# EAGLE schematic main (EAGLE 8.3.2)
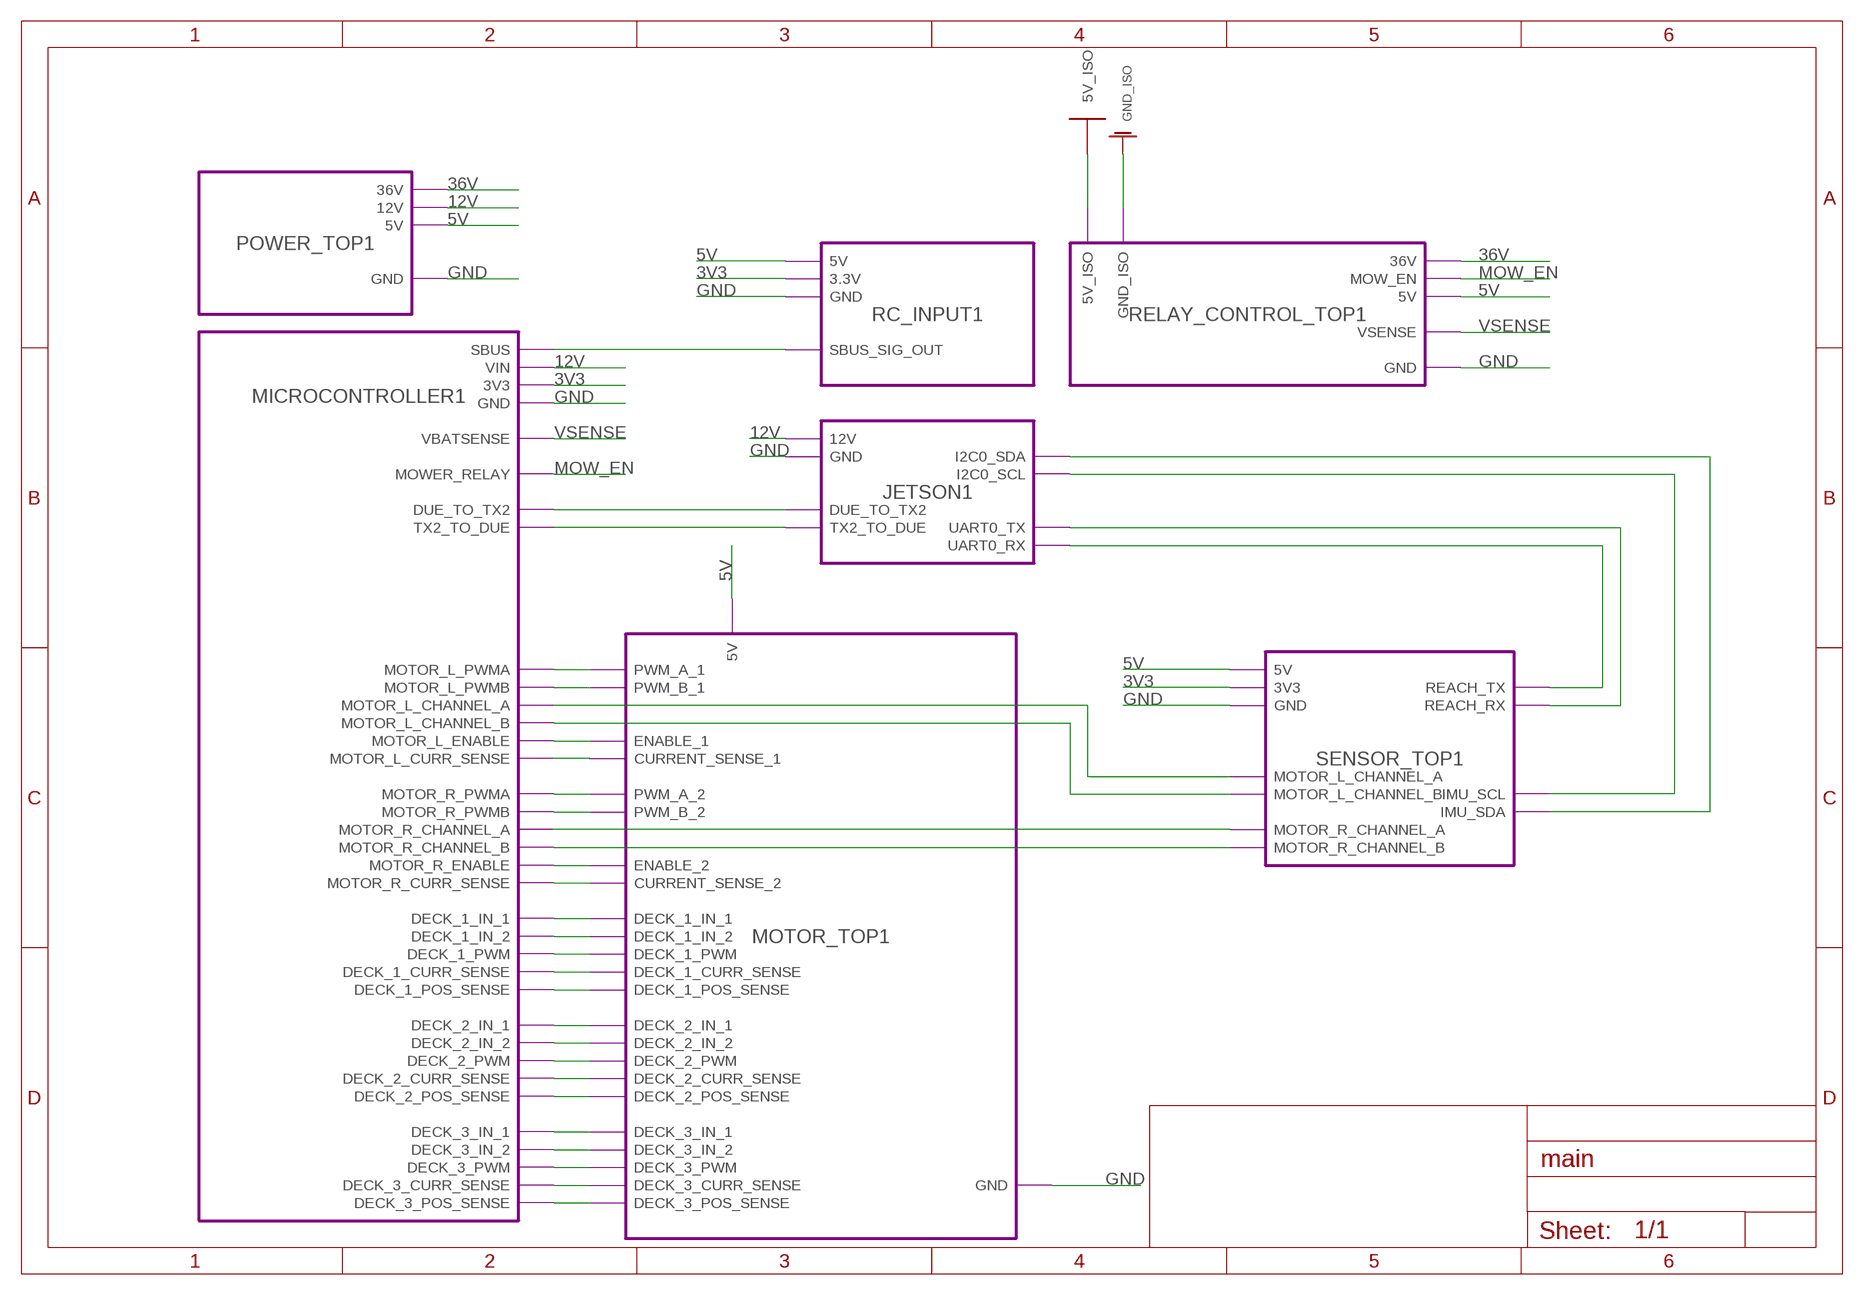
[diagram p0: schematic, sheet 1]

## Module instances
MICROCONTROLLER1 = UC
POWER_TOP1 = PWR
JETSON1 = JETSON
SENSOR_TOP1 = SNS
MOTOR_TOP1 = MTR
RC_INPUT1 = RC
RELAY_CONTROL_TOP1 = RL

## Nets
3V3: port MICROCONTROLLER1.3V3 RC_INPUT1.3.3V SENSOR_TOP1.3V3
5V: port POWER_TOP1.5V RC_INPUT1.5V SENSOR_TOP1.5V RELAY_CONTROL_TOP1.5V MOTOR_TOP1.5V
5V_ISO: port RELAY_CONTROL_TOP1.5V_ISO
12V: port POWER_TOP1.12V JETSON1.12V MICROCONTROLLER1.VIN
36V: port RELAY_CONTROL_TOP1.36V POWER_TOP1.36V
GND: port MICROCONTROLLER1.GND RC_INPUT1.GND POWER_TOP1.GND JETSON1.GND MOTOR_TOP1.GND SENSOR_TOP1.GND RELAY_CONTROL_TOP1.GND
GND_ISO: port RELAY_CONTROL_TOP1.GND_ISO
MOW_EN: port RELAY_CONTROL_TOP1.MOW_EN MICROCONTROLLER1.MOWER_RELAY
N$1: port MOTOR_TOP1.PWM_B_2 MICROCONTROLLER1.MOTOR_R_PWMB
N$2: port JETSON1.UART0_RX SENSOR_TOP1.REACH_TX
N$3: port MICROCONTROLLER1.MOTOR_L_ENABLE MOTOR_TOP1.ENABLE_1
N$4: port MICROCONTROLLER1.MOTOR_L_CURR_SENSE MOTOR_TOP1.CURRENT_SENSE_1
N$5: port MICROCONTROLLER1.MOTOR_R_PWMA MOTOR_TOP1.PWM_A_2
N$6: port JETSON1.UART0_TX SENSOR_TOP1.REACH_RX
N$7: port MICROCONTROLLER1.MOTOR_R_ENABLE MOTOR_TOP1.ENABLE_2
N$8: port MICROCONTROLLER1.MOTOR_R_CURR_SENSE MOTOR_TOP1.CURRENT_SENSE_2
N$9: port MICROCONTROLLER1.DECK_3_IN_1 MOTOR_TOP1.DECK_3_IN_1
N$10: port MICROCONTROLLER1.DECK_3_IN_2 MOTOR_TOP1.DECK_3_IN_2
N$11: port MICROCONTROLLER1.DECK_3_PWM MOTOR_TOP1.DECK_3_PWM
N$12: port MICROCONTROLLER1.DECK_3_POS_SENSE MOTOR_TOP1.DECK_3_POS_SENSE
N$13: port MICROCONTROLLER1.DECK_3_CURR_SENSE MOTOR_TOP1.DECK_3_CURR_SENSE
N$14: port MICROCONTROLLER1.DECK_2_POS_SENSE MOTOR_TOP1.DECK_2_POS_SENSE
N$15: port MICROCONTROLLER1.DECK_2_CURR_SENSE MOTOR_TOP1.DECK_2_CURR_SENSE
N$16: port MICROCONTROLLER1.DECK_2_PWM MOTOR_TOP1.DECK_2_PWM
N$17: port MICROCONTROLLER1.DECK_2_IN_2 MOTOR_TOP1.DECK_2_IN_2
N$18: port MICROCONTROLLER1.DECK_2_IN_1 MOTOR_TOP1.DECK_2_IN_1
N$19: port JETSON1.I2C0_SCL SENSOR_TOP1.IMU_SCL
N$20: port JETSON1.I2C0_SDA SENSOR_TOP1.IMU_SDA
N$21: port MICROCONTROLLER1.DECK_1_POS_SENSE MOTOR_TOP1.DECK_1_POS_SENSE
N$22: port MICROCONTROLLER1.DECK_1_CURR_SENSE MOTOR_TOP1.DECK_1_CURR_SENSE
N$23: port MICROCONTROLLER1.DECK_1_PWM MOTOR_TOP1.DECK_1_PWM
N$24: port MICROCONTROLLER1.DECK_1_IN_2 MOTOR_TOP1.DECK_1_IN_2
N$25: port MICROCONTROLLER1.DECK_1_IN_1 MOTOR_TOP1.DECK_1_IN_1
N$26: port MICROCONTROLLER1.MOTOR_L_PWMB MOTOR_TOP1.PWM_B_1
N$27: port MICROCONTROLLER1.MOTOR_L_PWMA MOTOR_TOP1.PWM_A_1
N$28: port JETSON1.TX2_TO_DUE MICROCONTROLLER1.TX2_TO_DUE
N$29: port MICROCONTROLLER1.DUE_TO_TX2 JETSON1.DUE_TO_TX2
N$30: port RC_INPUT1.SBUS_SIG_OUT MICROCONTROLLER1.SBUS
N$31: port MICROCONTROLLER1.MOTOR_L_CHANNEL_A SENSOR_TOP1.MOTOR_L_CHANNEL_A
N$32: port MICROCONTROLLER1.MOTOR_L_CHANNEL_B SENSOR_TOP1.MOTOR_L_CHANNEL_B
N$33: port SENSOR_TOP1.MOTOR_R_CHANNEL_A MICROCONTROLLER1.MOTOR_R_CHANNEL_A
N$34: port MICROCONTROLLER1.MOTOR_R_CHANNEL_B SENSOR_TOP1.MOTOR_R_CHANNEL_B
VSENSE: port MICROCONTROLLER1.VBATSENSE RELAY_CONTROL_TOP1.VSENSE

## Library data of the parts

## Module IMU
Ports: GND(pwr) IMU_SCL(io) IMU_SDA(io) IMU_VCC(pwr)
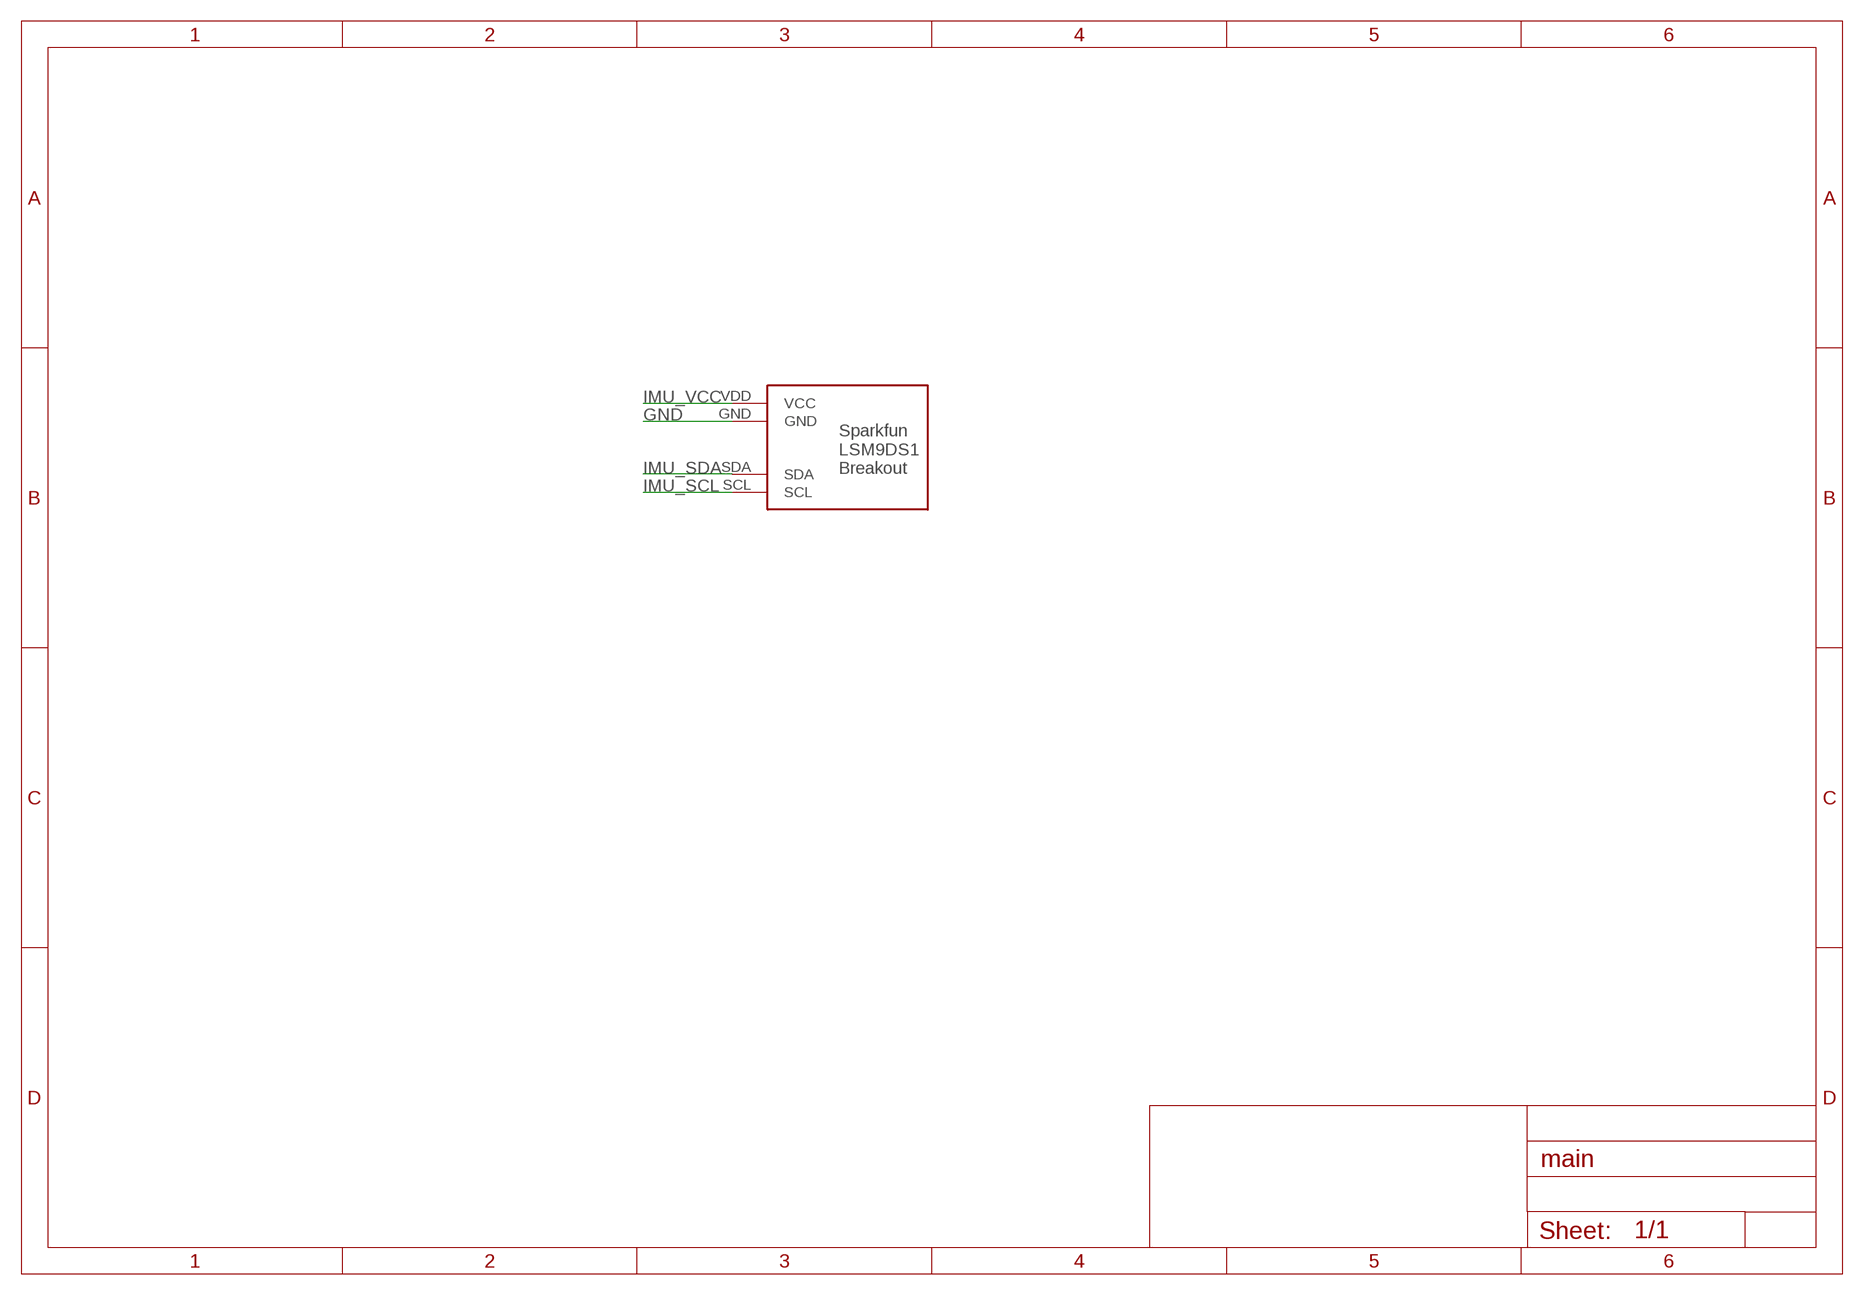
[diagram p1: schematic, module IMU, sheet 1]

### Parts
U$1  LSM9DS1  [SPARKFUN-9DOF-BREAKOUT]

### Nets
GND: U$1.GND
IMU_SCL: U$1.SCL
IMU_SDA: U$1.SDA
IMU_VCC: U$1.VDD(VCC)

### Library data of the parts
U$1 = sparkfun-IMU:LSM9DS1; DESCRIPTION: 9DoF IMU Breakout; MANUFACTURER: Sparkfun; MPN: LSM9DS1-Breakout

## Module UC
Ports: MOTOR_L_CURR_SENSE(io) MOTOR_L_ENABLE(io) MOTOR_L_CHANNEL_B(io) MOTOR_L_CHANNEL_A(io) MOTOR_L_PWMB(io) MOTOR_L_PWMA(io) MOTOR_R_PWMA(io) MOTOR_R_PWMB(io) MOTOR_R_CHANNEL_A(io) MOTOR_R_CHANNEL_B(io) MOTOR_R_ENABLE(io) MOTOR_R_CURR_SENSE(io) SBUS(io) MOWER_RELAY(io) VBATSENSE(io) GND(pwr) DECK_1_IN_1(io) DECK_1_IN_2(io) DECK_1_PWM(io) DECK_1_CURR_SENSE(io) DECK_1_POS_SENSE(io) DECK_2_IN_1(io) DECK_2_IN_2(io) DECK_2_PWM(io) DECK_2_CURR_SENSE(io) DECK_2_POS_SENSE(io) DECK_3_IN_1(io) DECK_3_IN_2(io) DECK_3_PWM(io) DECK_3_CURR_SENSE(io) DECK_3_POS_SENSE(io) DUE_TO_TX2(io) TX2_TO_DUE(io) 3V3(pwr) VIN(pwr)
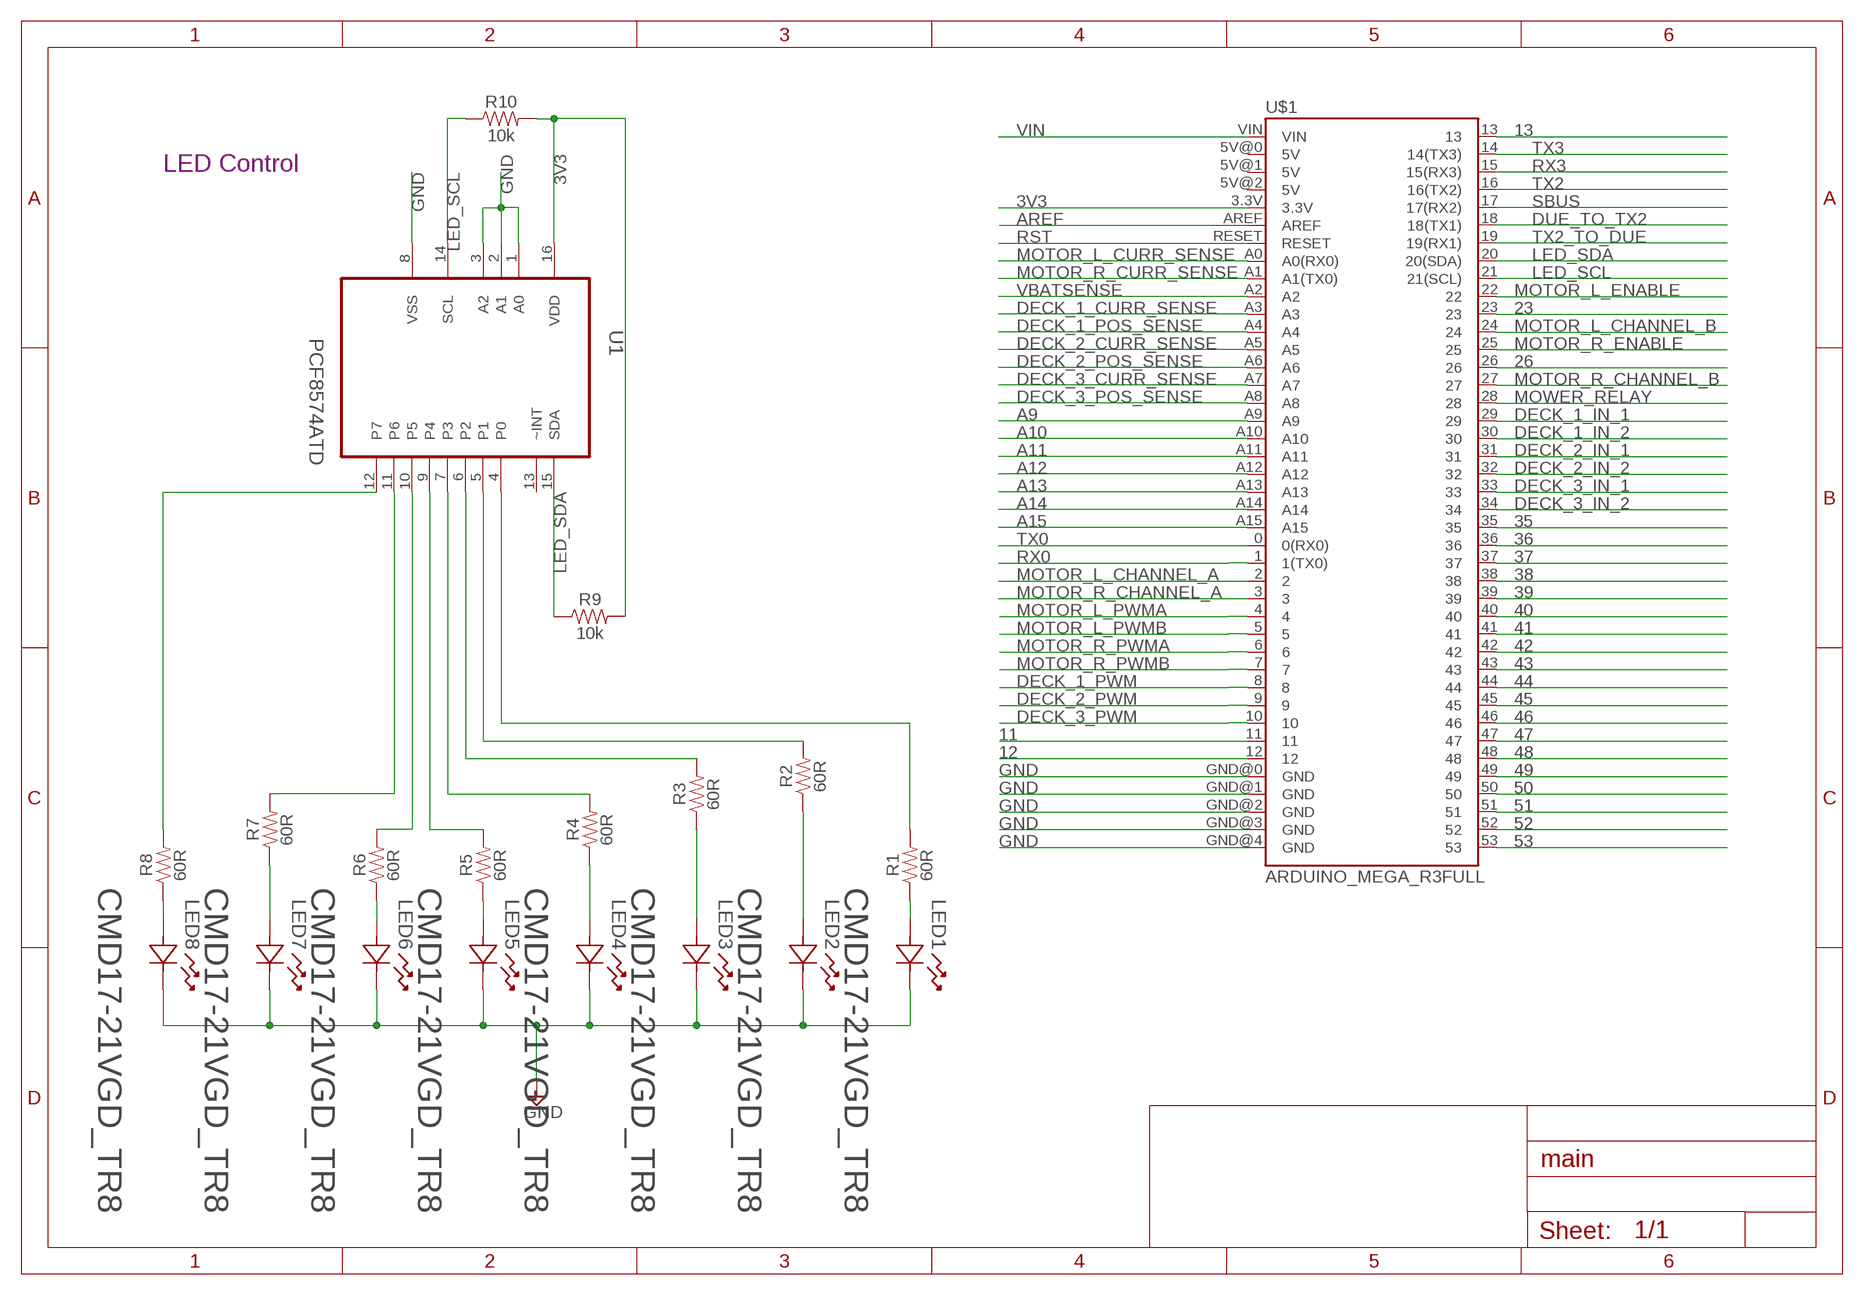
[diagram p2: schematic, module UC, sheet 1]

### Parts
LED1  CMD17-21VGD_TR8  [LED_CMD17-21VGD_TR8]
LED2  CMD17-21VGD_TR8  [LED_CMD17-21VGD_TR8]
LED3  CMD17-21VGD_TR8  [LED_CMD17-21VGD_TR8]
LED4  CMD17-21VGD_TR8  [LED_CMD17-21VGD_TR8]
LED5  CMD17-21VGD_TR8  [LED_CMD17-21VGD_TR8]
LED6  CMD17-21VGD_TR8  [LED_CMD17-21VGD_TR8]
LED7  CMD17-21VGD_TR8  [LED_CMD17-21VGD_TR8]
LED8  CMD17-21VGD_TR8  [LED_CMD17-21VGD_TR8]
R1  60R  60OHM-0603-1/10W-5%  [0603]
R2  60R  60OHM-0603-1/10W-5%  [0603]
R3  60R  60OHM-0603-1/10W-5%  [0603]
R4  60R  60OHM-0603-1/10W-5%  [0603]
R5  60R  60OHM-0603-1/10W-5%  [0603]
R6  60R  60OHM-0603-1/10W-5%  [0603]
R7  60R  60OHM-0603-1/10W-5%  [0603]
R8  60R  60OHM-0603-1/10W-5%  [0603]
R9  10k  10KOHM-0603-1/10W-5%  [0603]
R10  10k  10KOHM-0603-1/10W-5%  [0603]
U1  PCF8574ATD  [SOIC127P1032X265-16N]
U$1  ARDUINO_MEGA_R3FULL  [ARDUINO_MEGA]

### Nets
3V3: R9.2 R10.2 U1.16(VDD) U$1.3.3V
11: U$1.11
12: U$1.12
13: U$1.13
23: U$1.23
26: U$1.26
35: U$1.35
36: U$1.36
37: U$1.37
38: U$1.38
39: U$1.39
40: U$1.40
41: U$1.41
42: U$1.42
43: U$1.43
44: U$1.44
45: U$1.45
46: U$1.46
47: U$1.47
48: U$1.48
49: U$1.49
50: U$1.50
51: U$1.51
52: U$1.52
53: U$1.53
A9: U$1.A9
A10: U$1.A10
A11: U$1.A11
A12: U$1.A12
A13: U$1.A13
A14: U$1.A14
A15: U$1.A15
AREF: U$1.AREF
DECK_1_CURR_SENSE: U$1.A3
DECK_1_IN_1: U$1.29
DECK_1_IN_2: U$1.30
DECK_1_POS_SENSE: U$1.A4
DECK_1_PWM: U$1.8
DECK_2_CURR_SENSE: U$1.A5
DECK_2_IN_1: U$1.31
DECK_2_IN_2: U$1.32
DECK_2_POS_SENSE: U$1.A6
DECK_2_PWM: U$1.9
DECK_3_CURR_SENSE: U$1.A7
DECK_3_IN_1: U$1.33
DECK_3_IN_2: U$1.34
DECK_3_POS_SENSE: U$1.A8
DECK_3_PWM: U$1.10
DUE_TO_TX2: U$1.18(18(TX1))
GND: LED1.2 LED2.2 LED3.2 LED4.2 LED5.2 LED6.2 LED7.2 LED8.2 U1.1(A0) U1.2(A1) U1.3(A2) U1.8(VSS) U$1.GND@0(GND) U$1.GND@1(GND) U$1.GND@2(GND) U$1.GND@3(GND) U$1.GND@4(GND)
LED_SCL: R10.1 U1.14(SCL) U$1.21(21(SCL))
LED_SDA: R9.1 U1.15(SDA) U$1.20(20(SDA))
MOTOR_L_CHANNEL_A: U$1.2
MOTOR_L_CHANNEL_B: U$1.24
MOTOR_L_CURR_SENSE: U$1.A0(A0(RX0))
MOTOR_L_ENABLE: U$1.22
MOTOR_L_PWMA: U$1.4
MOTOR_L_PWMB: U$1.5
MOTOR_R_CHANNEL_A: U$1.3
MOTOR_R_CHANNEL_B: U$1.27
MOTOR_R_CURR_SENSE: U$1.A1(A1(TX0))
MOTOR_R_ENABLE: U$1.25
MOTOR_R_PWMA: U$1.6
MOTOR_R_PWMB: U$1.7
MOWER_RELAY: U$1.28
N$1: LED8.1 R8.1
N$2: R1.2 U1.4(P0)
N$3: LED7.1 R7.1
N$12: LED6.1 R6.1
N$13: LED5.1 R5.1
N$14: LED4.1 R4.1
N$15: LED3.1 R3.1
N$16: LED2.1 R2.1
N$17: LED1.1 R1.1
N$18: R8.2 U1.12(P7)
N$19: R7.2 U1.11(P6)
N$20: R6.2 U1.10(P5)
N$21: R5.2 U1.9(P4)
N$22: R4.2 U1.7(P3)
N$23: R3.2 U1.6(P2)
N$24: R2.2 U1.5(P1)
RST: U$1.RESET
RX0: U$1.1(1(TX0))
RX3: U$1.15(15(RX3))
SBUS: U$1.17(17(RX2))
TX0: U$1.0(0(RX0))
TX2: U$1.16(16(TX2))
TX2_TO_DUE: U$1.19(19(RX1))
TX3: U$1.14(14(TX3))
VBATSENSE: U$1.A2
VIN: U$1.VIN
Unconnected: U1.13(~INT) U$1.5V@0(5V) U$1.5V@1(5V) U$1.5V@2(5V)

### Notes on the sheet
- LED Control

### Library data of the parts
LED1-LED8 = CMD17-21VGD_TR8:CMD17-21VGD_TR8: LED, GREEN, 7MCD, 570NM; AVAILABILITY: Good; DESCRIPTION: Led, Green, 1.25mm x 1.4mm, 7mcd, 570nm, Full Reel; MANUFACTURER: Chicago Miniature Lighting; MPN: CMD17-21VGD/TR8; PACKAGE: 0805 Chicago Miniature Lighting; PRICE: 0.18 USD
R1-R8 = passive:60OHM: 2kΩ resistor A resistor is a passive two-terminal electrical component that implements electrical resistance as a circuit element. Resistors act to reduce current flow, and, at the same time, act to lower voltage levels within circuits. - Wikipedia; DESCRIPTION: RES SMD 60.4 OHM 1% 1/10W 0603; MANUFACTURER: Yageo; MPN: RC0603FR-0760R4L
R9 R10 = passive:10KOHM: 2kΩ resistor A resistor is a passive two-terminal electrical component that implements electrical resistance as a circuit element. Resistors act to reduce current flow, and, at the same time, act to lower voltage levels within circuits. - Wikipedia; DESCRIPTION: RES SMD 10K OHM 1% 1/10W 0603; MANUFACTURER: Yageo; MPN: RC0603FR-0710KL
U1 = PCF8574ATD:PCF8574ATD: Remote 8-bit I/O expander for I2C-bus; AVAILABILITY: Unavailable; DESCRIPTION: Smt t/r; MANUFACTURER: NXP Semiconductors; MPN: PCF8574ATD-T; PACKAGE: SOIC-16 NXP Semiconductors; PRICE: 1.10 USD
U$1 = SparkFun-Boards:ARDUINO_MEGA_R3: Arduino Mega R3 ATmega2560 R3 compatible footprint. SparkFun Products: Arduino Mega 2560 R3 <https://www.sparkfun.com/products/11061>

## Module URT
Ports: GND(io) RX(io) TX(io)
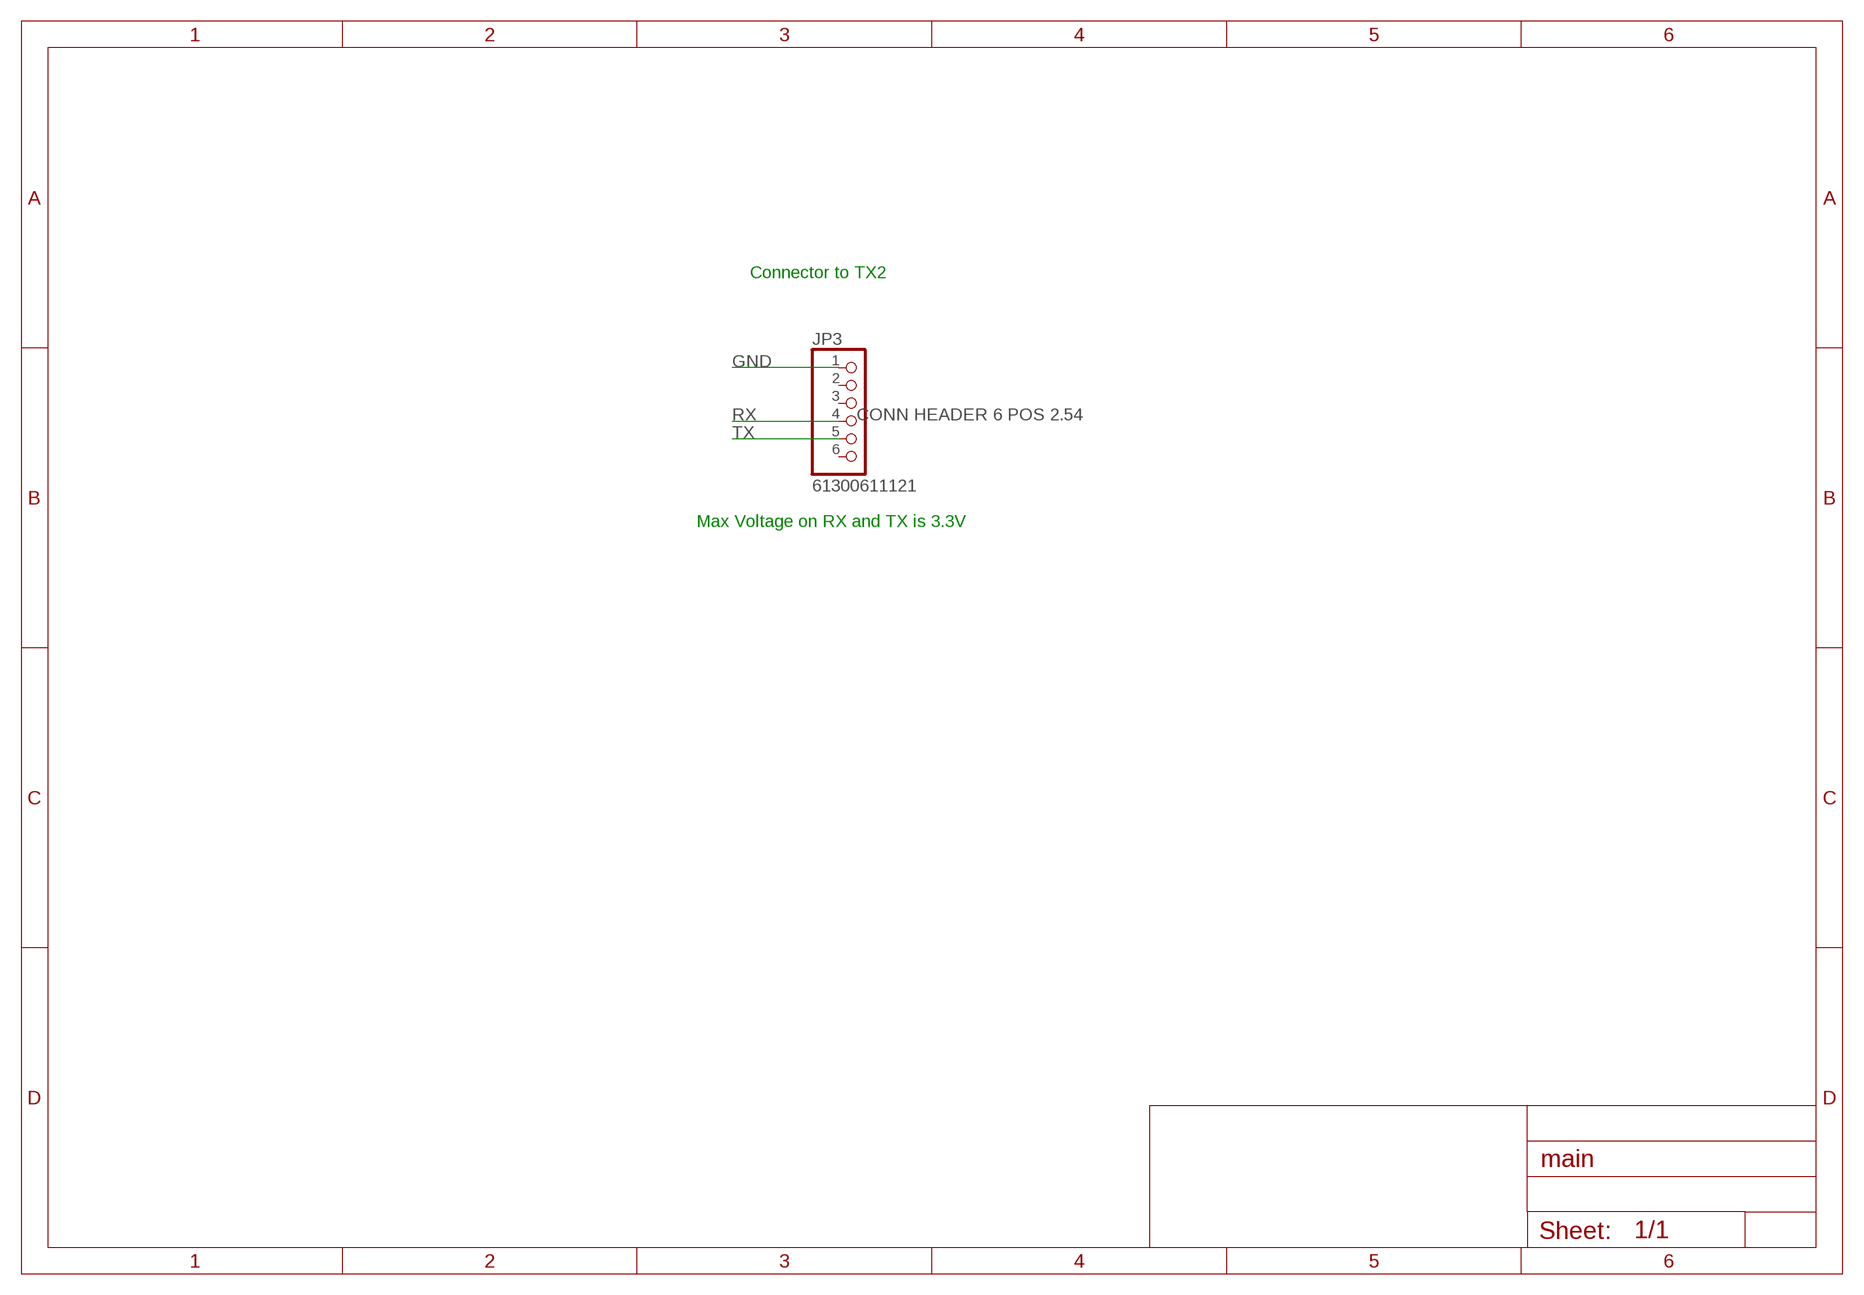
[diagram p3: schematic, module URT, sheet 1]

### Parts
JP3  61300611121  [1X06]

### Nets
GND: JP3.1
RX: JP3.4
TX: JP3.5
Unconnected: JP3.2 JP3.3 JP3.6

### Notes on the sheet
- Connector to TX2
- Max Voltage on RX and TX is 3.3V

### Library data of the parts
JP3 = power_connectors:61300611121: PIN HEADER; DESCRIPTION: CONN HEADER 6 POS 2.54; MANUFACTURER: Wurth; MPN: 61300611121; SILK: TX2UART

## Module RCH
Ports: 5V(pwr) GND(pwr) REACH_RX(io) REACH_TX(io)
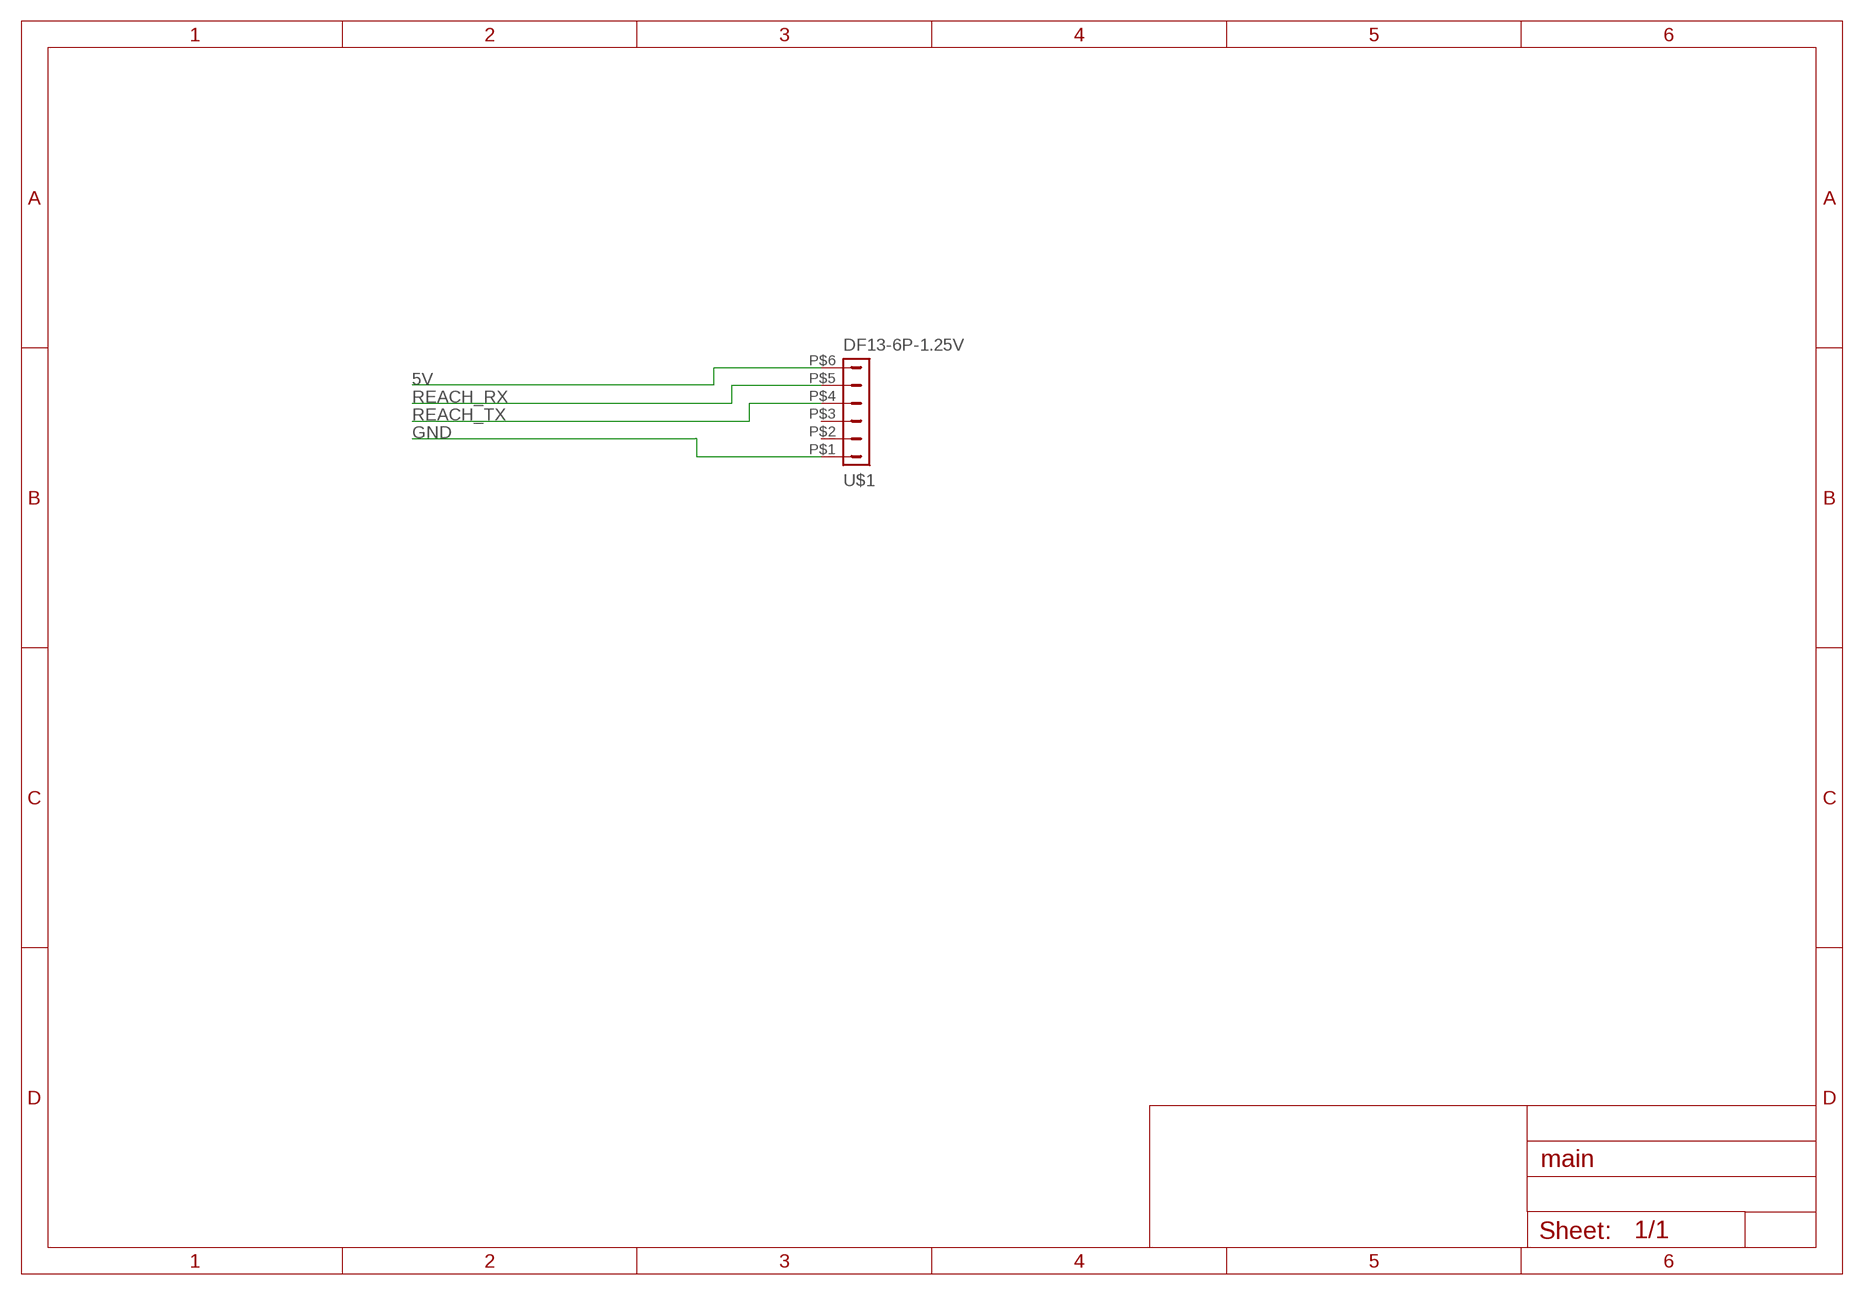
[diagram p4: schematic, module RCH, sheet 1]

### Parts
U$1  DF13-6P-1.25V  [DF13C-6P-1.25V]

### Nets
5V: U$1.P$6
GND: U$1.P$1
REACH_RX: U$1.P$5
REACH_TX: U$1.P$4
Unconnected: U$1.P$2 U$1.P$3

### Library data of the parts
U$1 = con-hirose-df13:DF13-6P-1.25: DF13-6P 1.25mm Pitch Miniature Crimping Connector.; DESCRIPTION: CONN HEADER 6POS 1.25MM SMD GOLD; MANUFACTURER: Hirose; MPN: DF13-6P-1.25V(50); SILK: GPSUART

## Module PWR
Ports: 12V(pwr) 5V(pwr) GND(pwr) 36V(pwr)
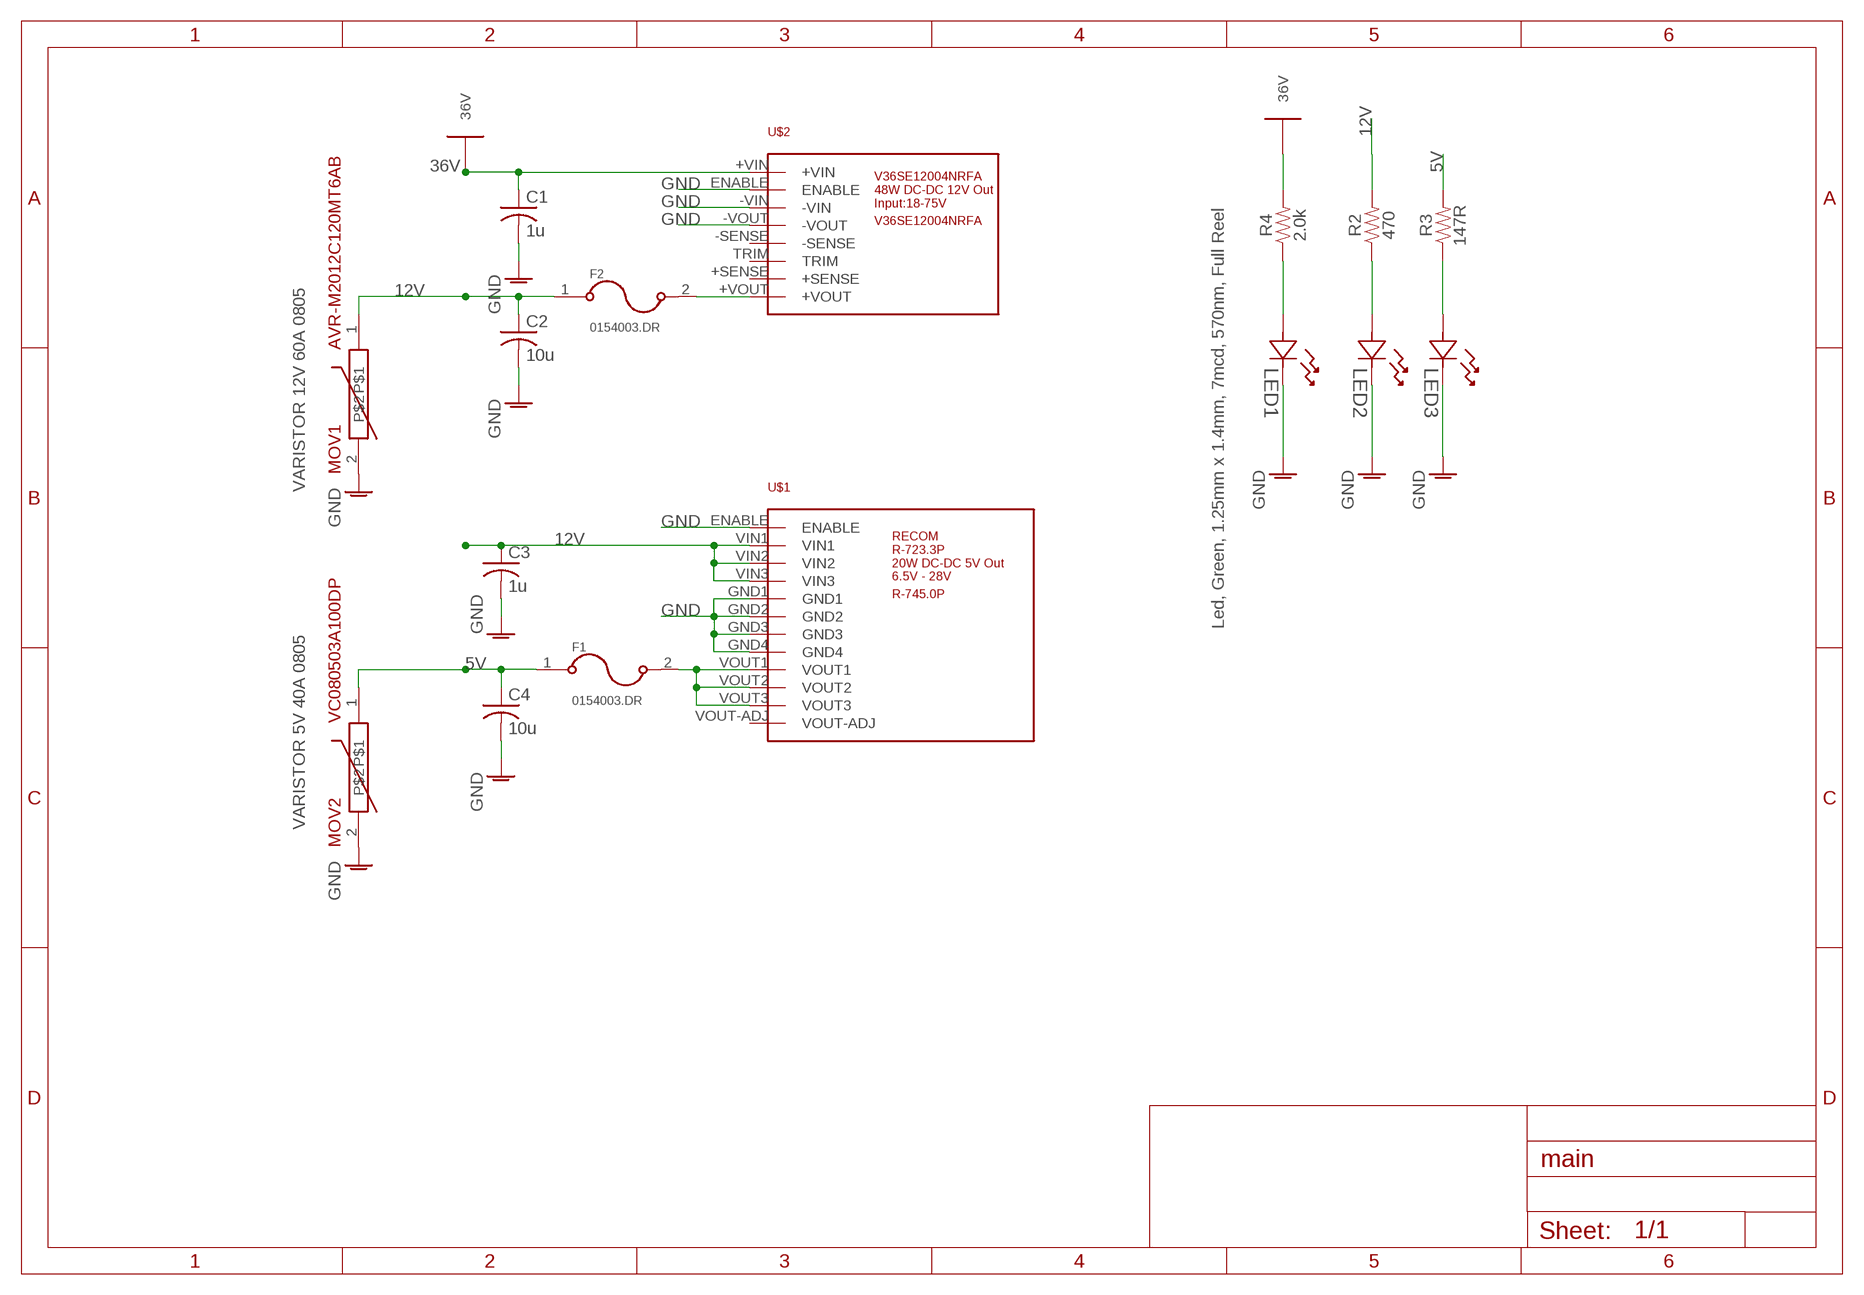
[diagram p5: schematic, module PWR, sheet 1]

### Parts
C1  1u  1UF  [C0603]
C2  10u  10UF  [C0603]
C3  1u  1UF  [C0603]
C4  10u  10UF  [C0603]
F1  0154003.DR  [FUSE_0154004.DR]
F2  0154003.DR  [FUSE_0154004.DR]
LED1  CMD17-21VGD_TR8  [LED_CMD17-21VGD_TR8]
LED2  CMD17-21VGD_TR8  [LED_CMD17-21VGD_TR8]
LED3  CMD17-21VGD_TR8  [LED_CMD17-21VGD_TR8]
MOV1  AVR-M2012C120MT6AB  [0805]
MOV2  VC080503A100DP  [0805]
R2  470  470OHM-0603-1/10W-5%  [0603]
R3  147R  147OHM-0603-1/10W-5%  [0603]
R4  2.0k  2.0KOHM-0603-1/10W-5%  [0603]
U$1  R-745.0P  [SIP-12]
U$2  V36SE12004NRFA  [V36SE12004NRFA-TH]

### Nets
5V: C4.1 F1.1 MOV2.1 R3.2
12V: C2.1 C3.1 F2.1 MOV1.1 R2.2 U$1.VIN1 U$1.VIN2 U$1.VIN3
36V: C1.1 R4.2 U$2.+VIN
GND: C1.2 C2.2 C3.2 C4.2 LED1.2 LED2.2 LED3.2 MOV1.2 MOV2.2 U$1.ENABLE U$1.GND1 U$1.GND2 U$1.GND3 U$1.GND4 U$2.-VIN U$2.-VOUT U$2.ENABLE
N$1: F2.2 U$2.+VOUT
N$2: F1.2 U$1.VOUT1 U$1.VOUT2 U$1.VOUT3
N$3: LED1.1 R4.1
N$4: LED2.1 R2.1
N$5: LED3.1 R3.1
Unconnected: U$1.VOUT-ADJ U$2.+SENSE U$2.-SENSE U$2.TRIM

### Library data of the parts
C1 C3 = passive:1UF; DESCRIPTION: CAP CER 1UF 25V X5R 0603; MANUFACTURER: Taiyo Yuden; MPN: TMK107BJ105KA-T
C2 C4 = passive:10UF; DESCRIPTION: CAP CER 10UF 25V X5R 0603; MANUFACTURER: Murata; MPN: GRM188R61E106MA73D
F1 F2 = fuses:0154003.DR: 154/154T/154L/154TL Series OMNI-BLOK® Fuse and Holder Assembly; AVAILABILITY: Good; DESCRIPTION: Fuse Chip Very Fast Acting 4A SMD Solder Pad 9.73 X 5.03 X 3.81mm T/R CSA/PSE/UL; MANUFACTURER: Littelfuse; MPN: 0154003.DR; PACKAGE: None; PRICE: 1.54 USD
LED1-LED3 = CMD17-21VGD_TR8:CMD17-21VGD_TR8: LED, GREEN, 7MCD, 570NM; AVAILABILITY: Good; DESCRIPTION: Led, Green, 1.25mm x 1.4mm, 7mcd, 570nm, Full Reel; MANUFACTURER: Chicago Miniature Lighting; MPN: CMD17-21VGD/TR8; PACKAGE: 0805 Chicago Miniature Lighting; PRICE: 0.18 USD
MOV1 = power_supplies:AVR-M2012C120MT6AB; DESCRIPTION: VARISTOR 12V 60A 0805; MANUFACTURER: TDK Corporation; MPN: AVR-M2012C120MT6AB
MOV2 = power_supplies:VC080503A100DP; DESCRIPTION: VARISTOR 5V 40A 0805; MANUFACTURER: Avx; MPN: VC080503A100DP
R2 = passive:470OHM: 2kΩ resistor A resistor is a passive two-terminal electrical component that implements electrical resistance as a circuit element. Resistors act to reduce current flow, and, at the same time, act to lower voltage levels within circuits. - Wikipedia; DESCRIPTION: RES SMD 470 OHM 1% 1/10W 0603; MANUFACTURER: Yageo; MPN: RC0603FR-07470RL
R3 = passive:147OHM: 2kΩ resistor A resistor is a passive two-terminal electrical component that implements electrical resistance as a circuit element. Resistors act to reduce current flow, and, at the same time, act to lower voltage levels within circuits. - Wikipedia; DESCRIPTION: RES SMD 147 OHM 1% 1/10W 0603; MANUFACTURER: Yageo; MPN: RC0603FR-07147RL
R4 = passive:2.0KOHM: 2kΩ resistor A resistor is a passive two-terminal electrical component that implements electrical resistance as a circuit element. Resistors act to reduce current flow, and, at the same time, act to lower voltage levels within circuits. - Wikipedia; DESCRIPTION: RES SMD 2K OHM 5% 1/10W 0603; MANUFACTURER: Yageo; MPN: RC0603JR-072KL; PROD_ID: RES-08296
U$1 = power_supplies:R-745.0P; DESCRIPTION: CONV DC/DC 2A 6.5-28VIN 5V; MANUFACTURER: Recom; MPN: R-725.0P
U$2 = power_supplies:V36SE12004NRFA; DESCRIPTION: MODULE DC/DC 1/16 BRICK 12V 4A; MANUFACTURER: Delta Electronics; MPN: V36SE12004NRFA

## Module RC
Ports: 5V(pwr) GND(pwr) SBUS_SIG_OUT(io) 3.3V(pwr)
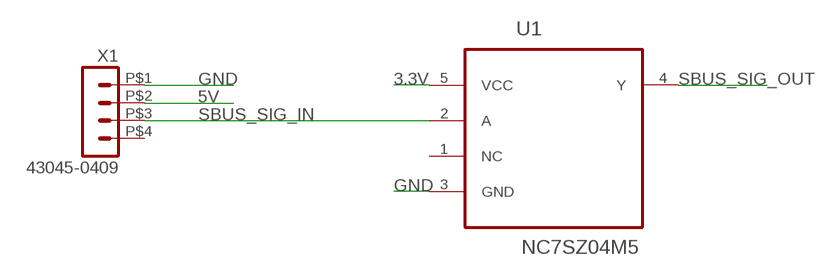
[diagram p6: schematic, module RC, sheet 1]

### Parts
U1  NC7SZ04M5  [SOT95P280X145-5N]
X1  43045-0409  HEADER_POS4_43045-0409  [43045-0409]

### Nets
3.3V: U1.5(VCC)
5V: X1.P$2
GND: U1.3(GND) X1.P$1
SBUS_SIG_IN: U1.2(A) X1.P$3
SBUS_SIG_OUT: U1.4(Y)
Unconnected: U1.1(NC) X1.P$4

### Library data of the parts
U1 = NC7SZ04M5:NC7SZ04M5: Tiny logic UHS Inverter; AVAILABILITY: Good; DESCRIPTION: NC7SZ04 Series 5.5 V Surface Mount TinyLogic UHS Inverter - SOT-23-5; MANUFACTURER: Fairchild Semiconductor; MPN: NC7SZ04M5; PACKAGE: SOT-23-5 Fairchild Semiconductor; PRICE: 0.28 USD
X1 = con-molex-micro-fit-3_0:HEADER_POS4_?: Molex - Micro-Fit 3.0 Series connector, 3.00mm (0.118") pitch header, 4 positions.; DESCRIPTION: CONN HEADER 4POS RT ANG SMD TIN; MANUFACTURER: Molex; MPN: 43045-0409; SILK: RCRX

## Module ENC
Ports: 5V(pwr) GND(pwr) CHANNEL_A(io) CHANNEL_B(io)
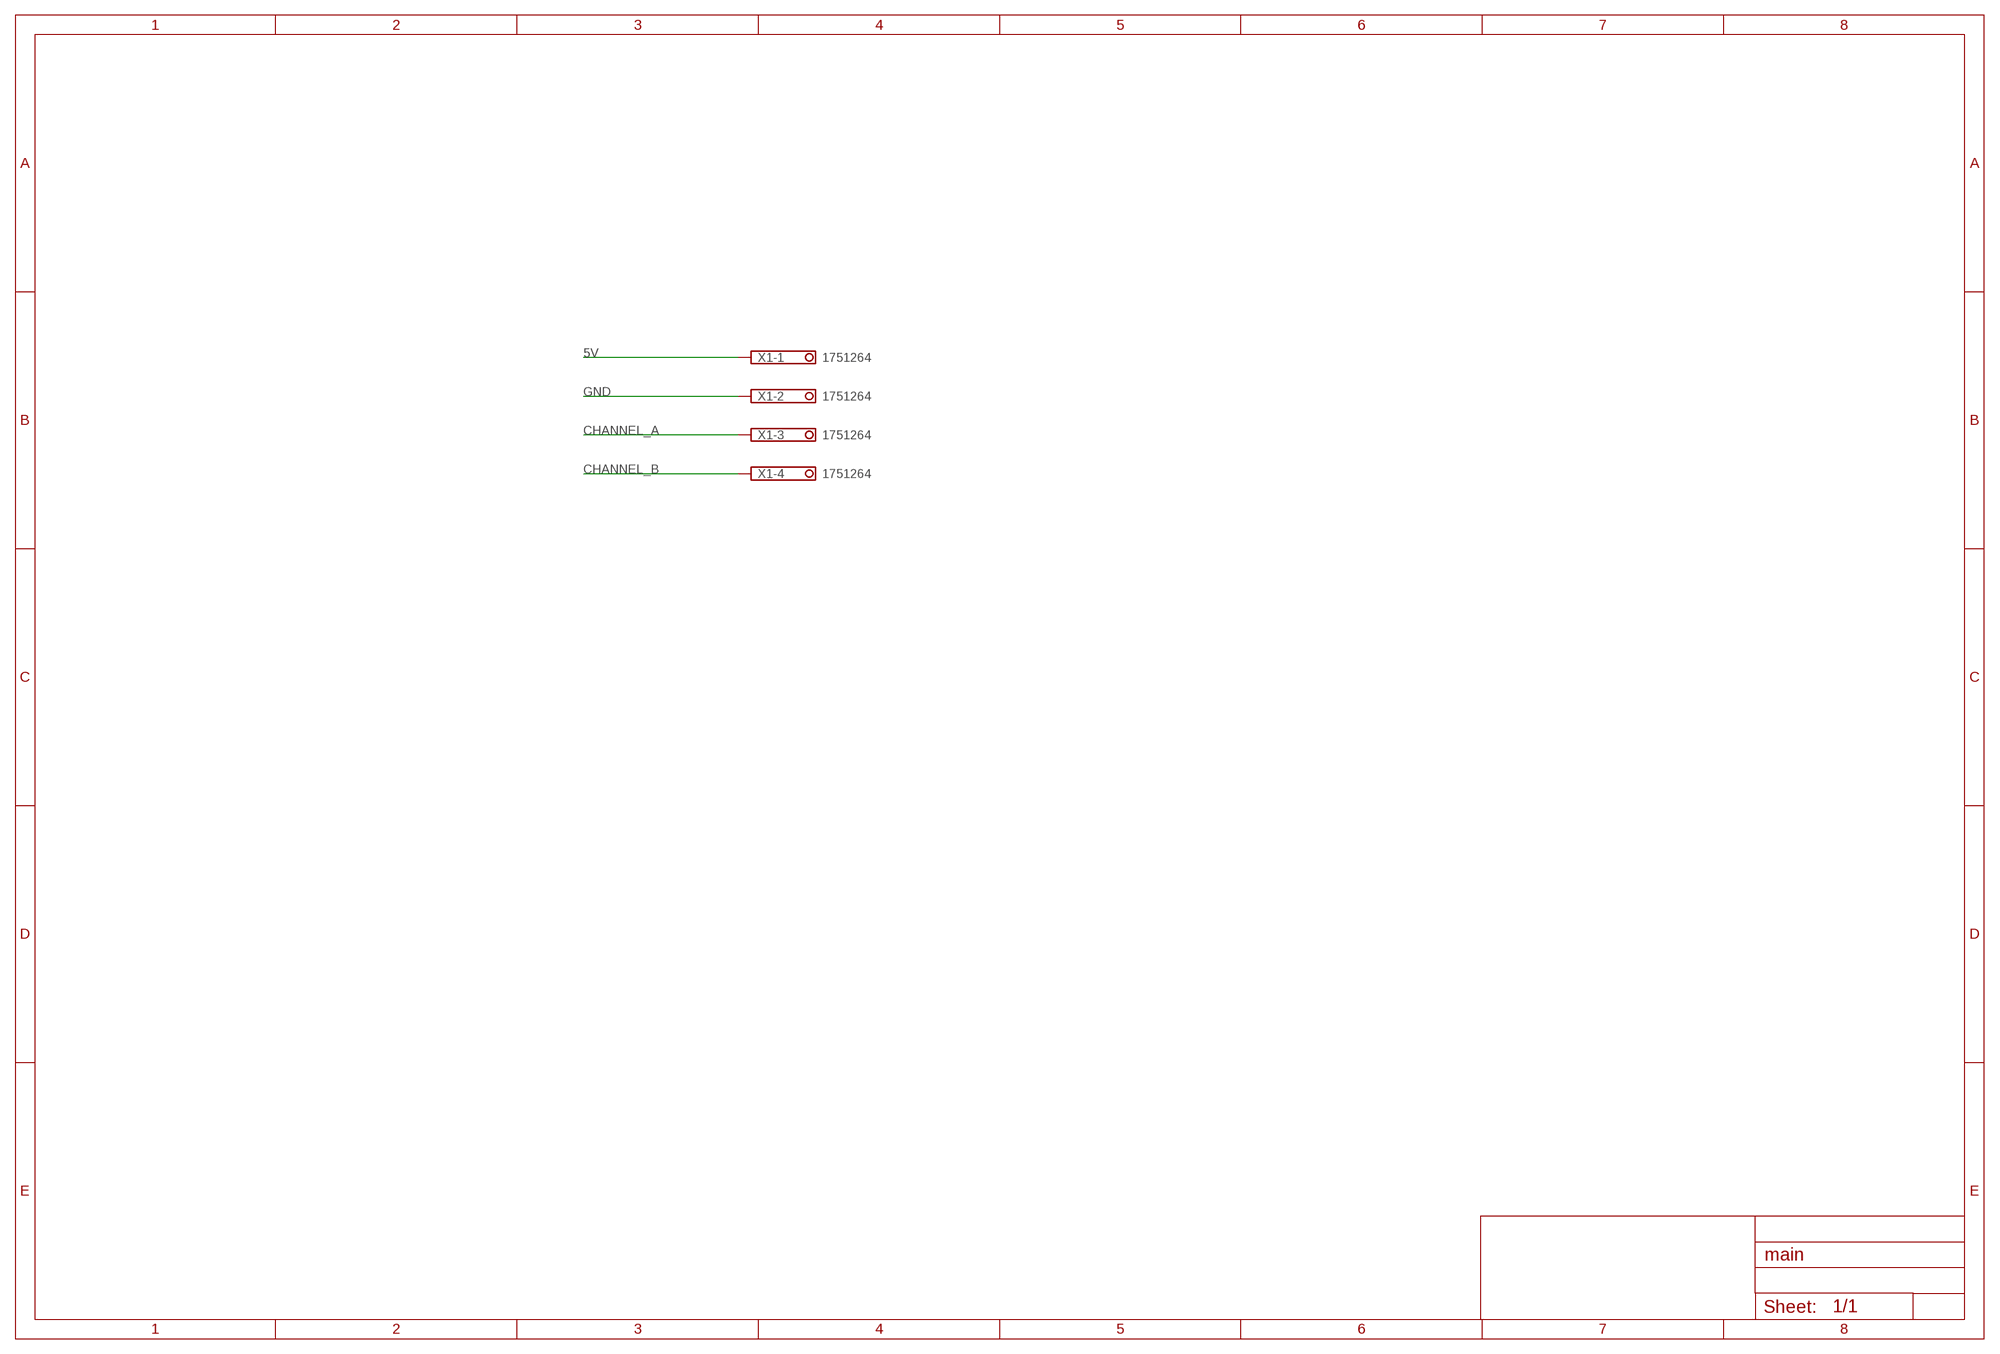
[diagram p7: schematic, module ENC, sheet 1]

### Parts
X1  1751264  [1751264]

### Nets
5V: X1.1
CHANNEL_A: X1.3
CHANNEL_B: X1.4
GND: X1.2

### Library data of the parts
X1 = power_connectors:1751264: MKDS 1/ 4-3,5 Printklemme Nennstrom: 10 A Bemessungsspannung: 160 V Raster: 3,5 mm Polzahl: 4 Montageart: Löten Anschlussart: Schraubanschluss Anschlussrichtung vom Leiter zur Platine: 0° Source: http://eshop.phoenixcontact.com .. 1751264.pdf; DESCRIPTION: CONN TERM BLOCK 4POS 3.5MM; MANUFACTURER: Phoenix Contact; MPN: 1751264

## Module ISO
Ports: 36V_RAW(pwr) 5V_ISO(pwr) GND_ISO(pwr) 5V(pwr) GND(pwr) MOW_EN(io) MOW_EN_ISO(io) VSENSE(io)
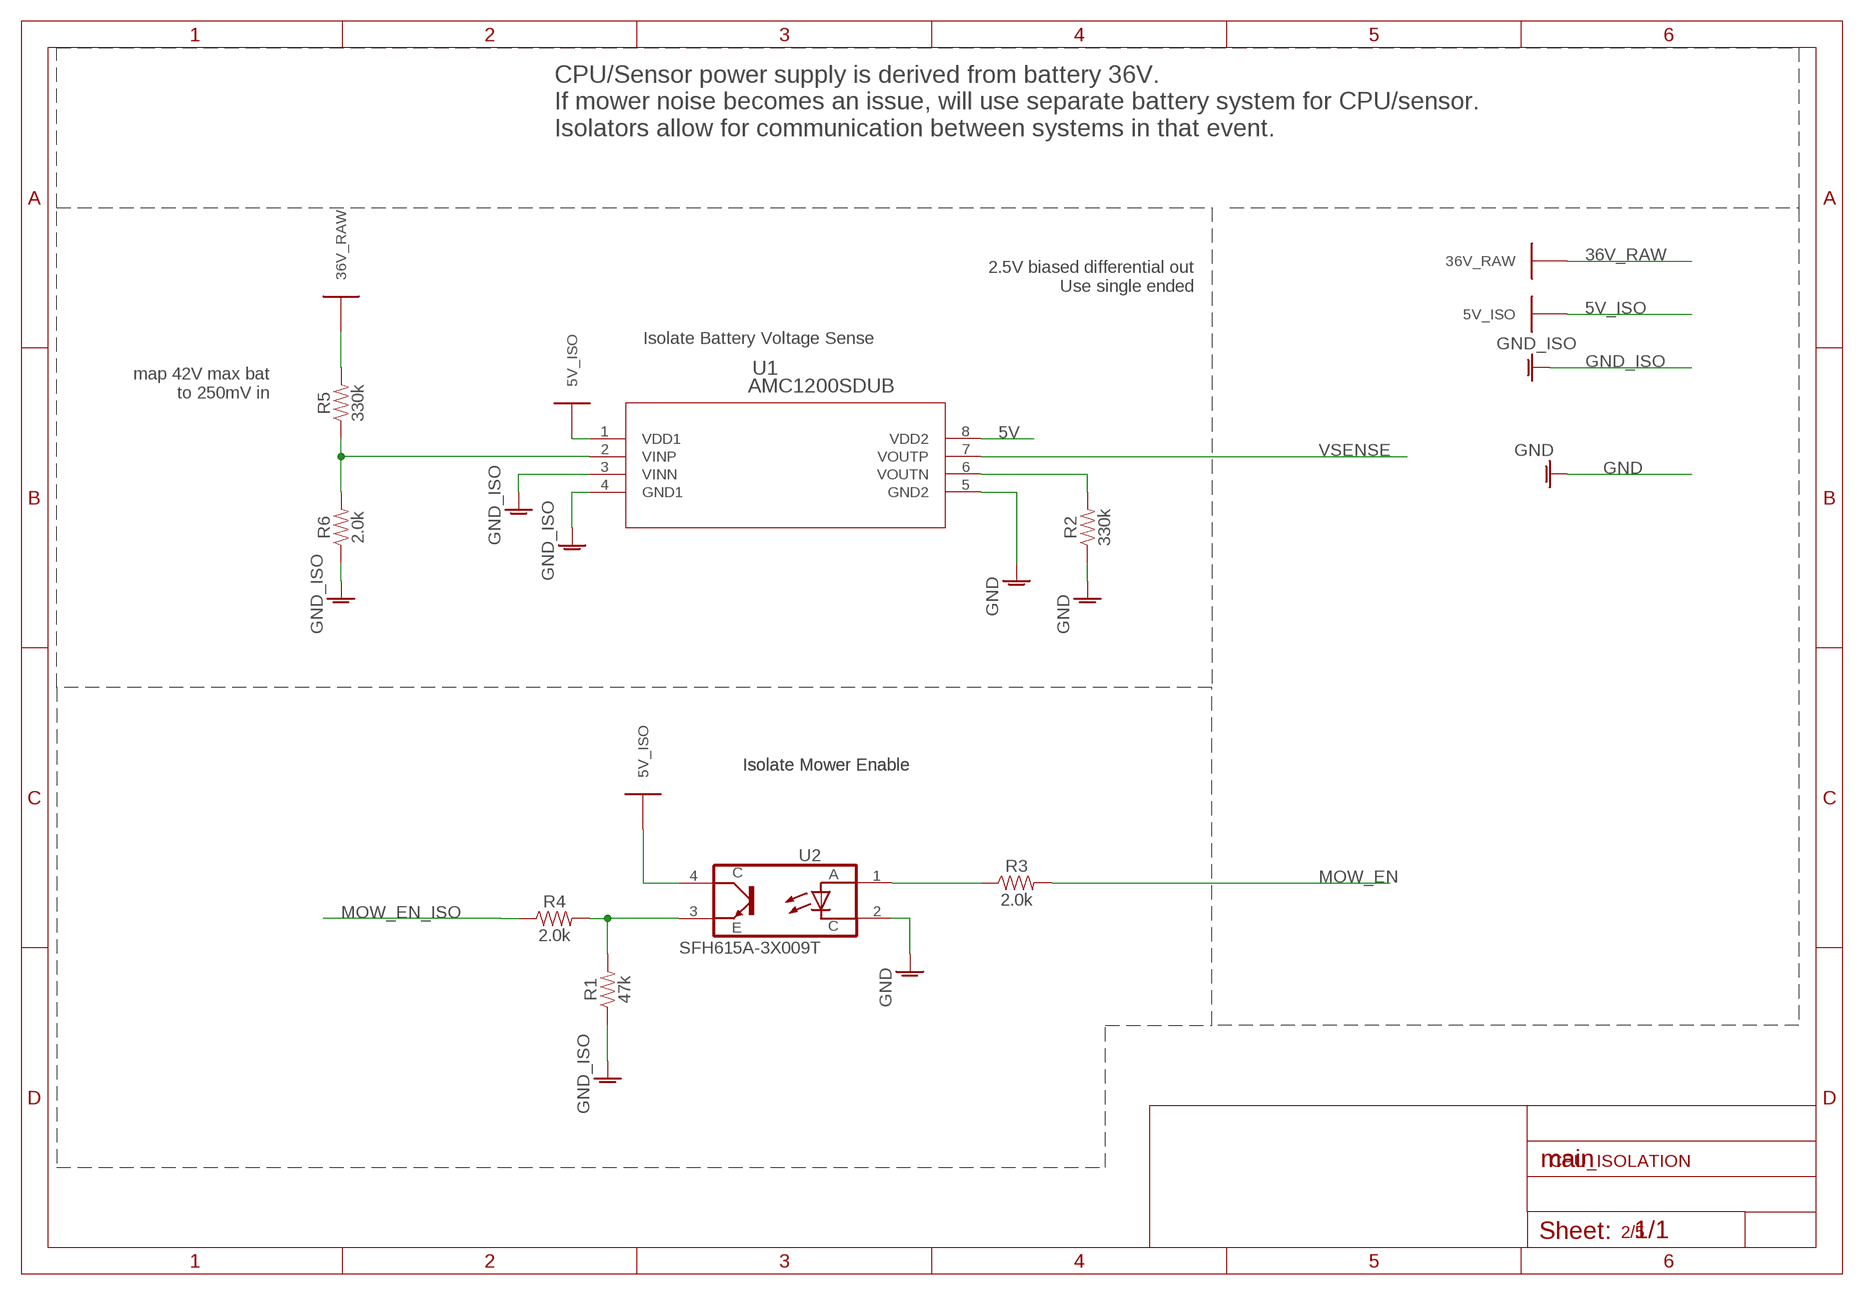
[diagram p8: schematic, module ISO, sheet 1]

### Parts
R1  47k  47KOHM-0603-1/10W-1%  [0603]
R2  330k  330KOHM-0603-1/10W-1%  [0603]
R3  2.0k  2.0KOHM-0603-1/10W-5%  [0603]
R4  2.0k  2.0KOHM-0603-1/10W-5%  [0603]
R5  330k  330KOHM-0603-1/10W-1%  [0603]
R6  2.0k  2.0KOHM-0603-1/10W-5%  [0603]
U1  AMC1200SDUB  [DUB8]
U2  SFH615A-3X009T  [SOIC254P1016X390-4N]

### Nets
5V: U1.8(VDD2)
5V_ISO: U1.1(VDD1) U2.4(CO)
36V_RAW: R5.2
GND: R2.1 U1.5(GND2) U2.2(C)
GND_ISO: R1.1 R6.1 U1.3(VINN) U1.4(GND1)
MOW_EN: R3.2
MOW_EN_ISO: R4.1
N$1: R2.2 U1.6(VOUTN)
N$2: R5.1 R6.2 U1.2(VINP)
N$3: R1.2 R4.2 U2.3(E)
N$4: R3.1 U2.1(A)
VSENSE: U1.7(VOUTP)

### Notes on the sheet
- CPU/Sensor power supply is derived from battery 36V.
  If mower noise becomes an issue, will use separate battery system for CPU/sensor.
  Isolators allow for communication between systems in that event.
- 2.5V biased differential out
  Use single ended
- Isolate Battery Voltage Sense
- map 42V max bat
  to 250mV in
- Isolate Mower Enable | Isolate Mower Enable
- CPU_ISOLATION
- 2/5

### Library data of the parts
R1 = passive:47KOHM: 47kΩ resistor A resistor is a passive two-terminal electrical component that implements electrical resistance as a circuit element. Resistors act to reduce current flow, and, at the same time, act to lower voltage levels within circuits. - Wikipedia; DESCRIPTION: RES SMD 47K OHM 1% 1/10W 0603; MANUFACTURER: Yageo; MPN: RC0603FR-0747KL; PROD_ID: RES-07871
R2 R5 = passive:330KOHM: 330kΩ resistor A resistor is a passive two-terminal electrical component that implements electrical resistance as a circuit element. Resistors act to reduce current flow, and, at the same time, act to lower voltage levels within circuits. - Wikipedia; DESCRIPTION: RES SMD 330K OHM 1% 1/10W 0603; MANUFACTURER: Yageo; MPN: RC0603FR-07330KL; PROD_ID: RES-08968
R3 R4 R6 = passive:2.0KOHM: 2kΩ resistor A resistor is a passive two-terminal electrical component that implements electrical resistance as a circuit element. Resistors act to reduce current flow, and, at the same time, act to lower voltage levels within circuits. - Wikipedia; DESCRIPTION: RES SMD 2K OHM 5% 1/10W 0603; MANUFACTURER: Yageo; MPN: RC0603JR-072KL; PROD_ID: RES-08296
U1 = power_supplies:AMC1200SDUB; DESCRIPTION: IC OPAMP ISOLATION 100KHZ 8SOP; MANUFACTURER: Texas Instruments; MPN: AMC1200SDUB
U2 = SFH615A-3X009T:SFH615A-3X009T; AVAILABILITY: Good; DESCRIPTION: Optocoupler DC-IN 1-CH Transistor DC-OUT 4-Pin PDIP SMD T/R; MANUFACTURER: Vishay Semiconductor; MPN: SFH615A-3X009T; PACKAGE: SMD-4 Vishay; PRICE: 0.48 USD

## Module REG
Ports: 36V_RAW(pwr) 5V_ISO(pwr) GND_ISO(pwr)
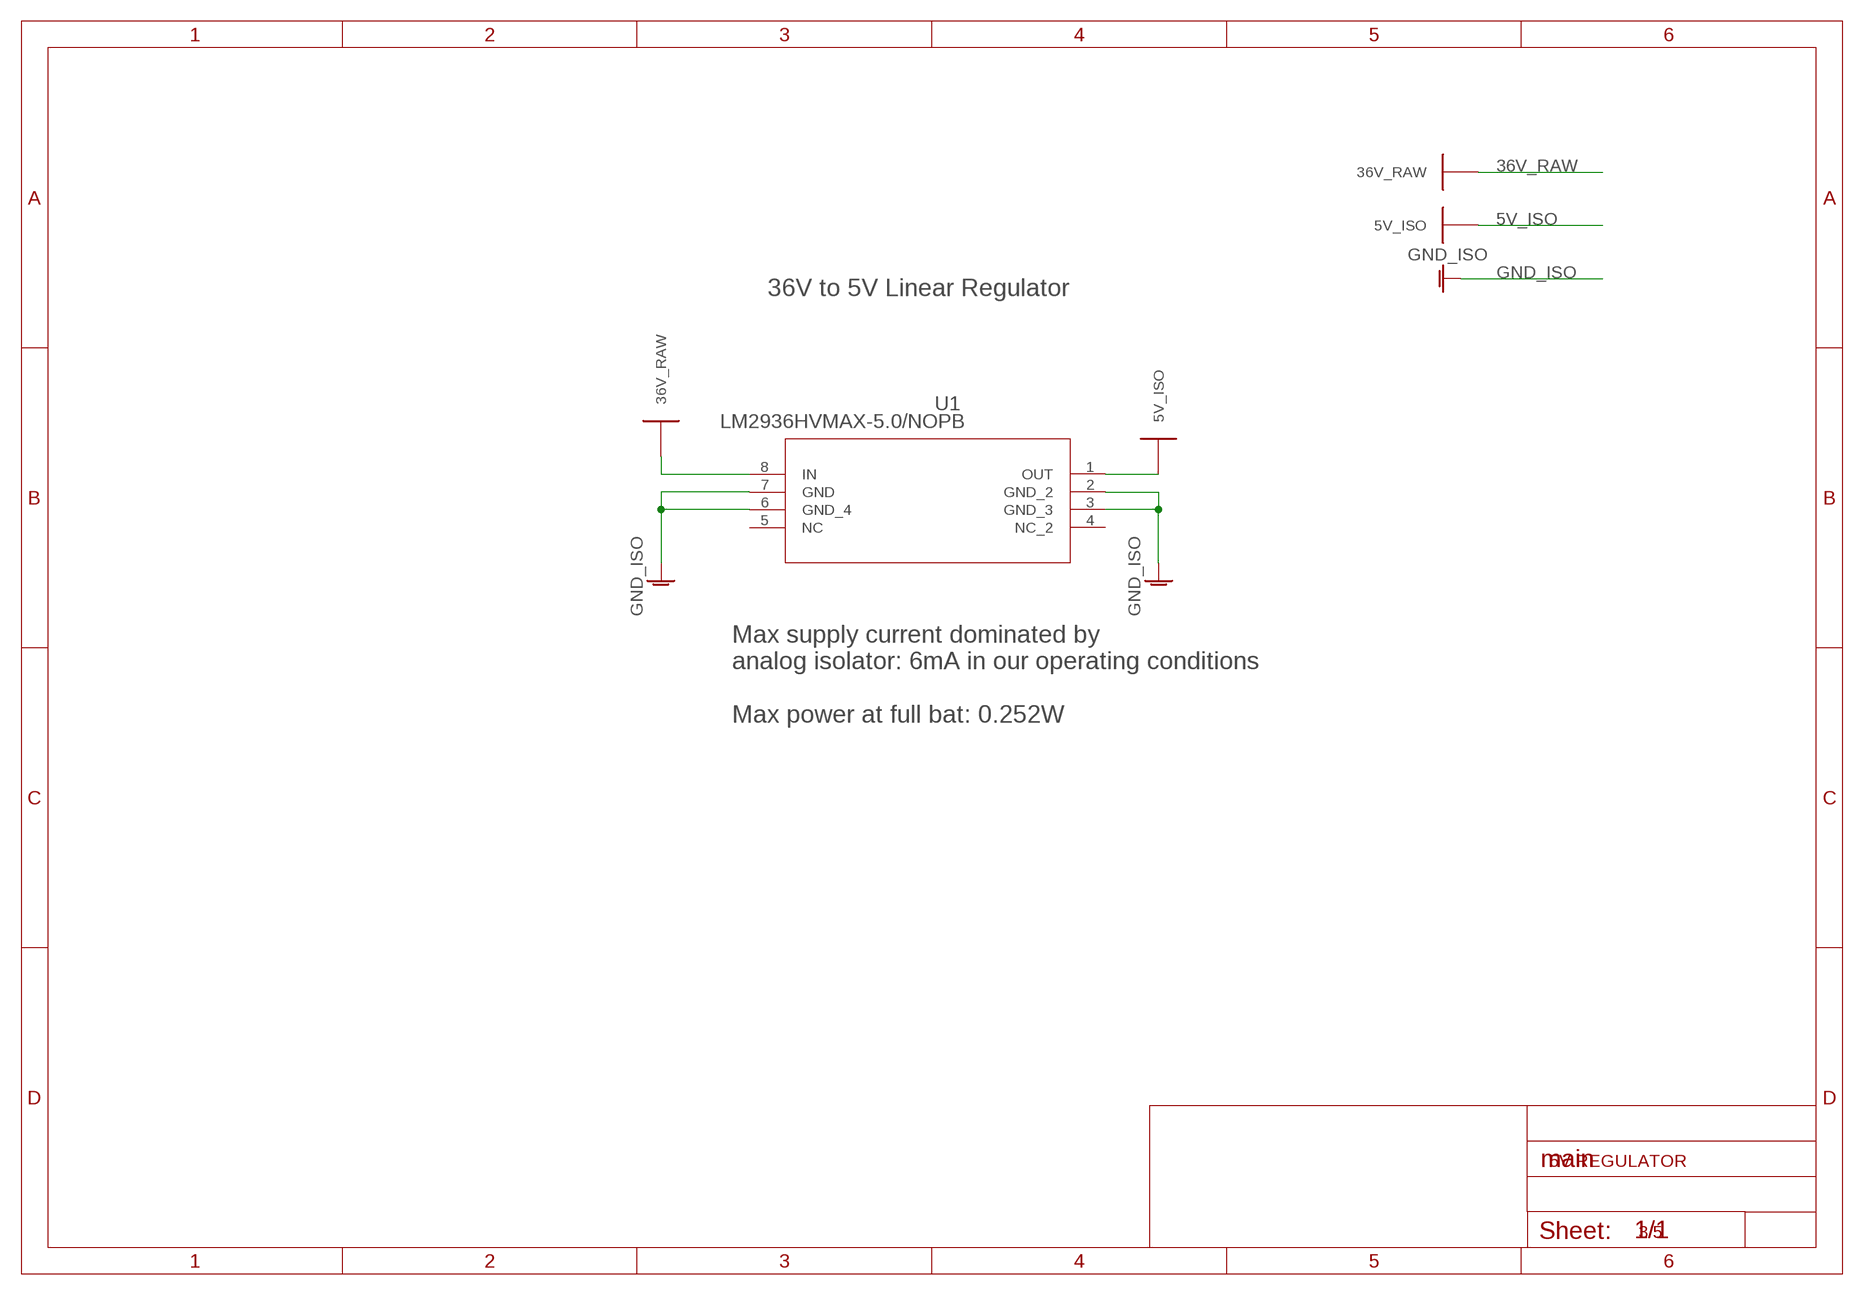
[diagram p9: schematic, module REG, sheet 1]

### Parts
U1  LM2936HVMAX-5.0/NOPB  [M08A]

### Nets
5V_ISO: U1.1(OUT)
36V_RAW: U1.8(IN)
GND_ISO: U1.2(GND_2) U1.3(GND_3) U1.6(GND_4) U1.7(GND)
Unconnected: U1.4(NC_2) U1.5(NC)

### Notes on the sheet
- 36V to 5V Linear Regulator
- Max supply current dominated by
  analog isolator: 6mA in our operating conditions
  
  Max power at full bat: 0.252W
- 5V REGULATOR
- 3/5

### Library data of the parts
U1 = power_supplies:LM2936HVMAX-5.0/NOPB; DESCRIPTION: IC REG LINEAR 5V 50MA 8SOIC; MANUFACTURER: Texas Instruments; MPN: LM2936HVMAX5.0NOPB

## Module UVLO
Ports: !UVLO!(io) 5V_ISO(pwr) 36V_RAW(pwr) GND_ISO(io)
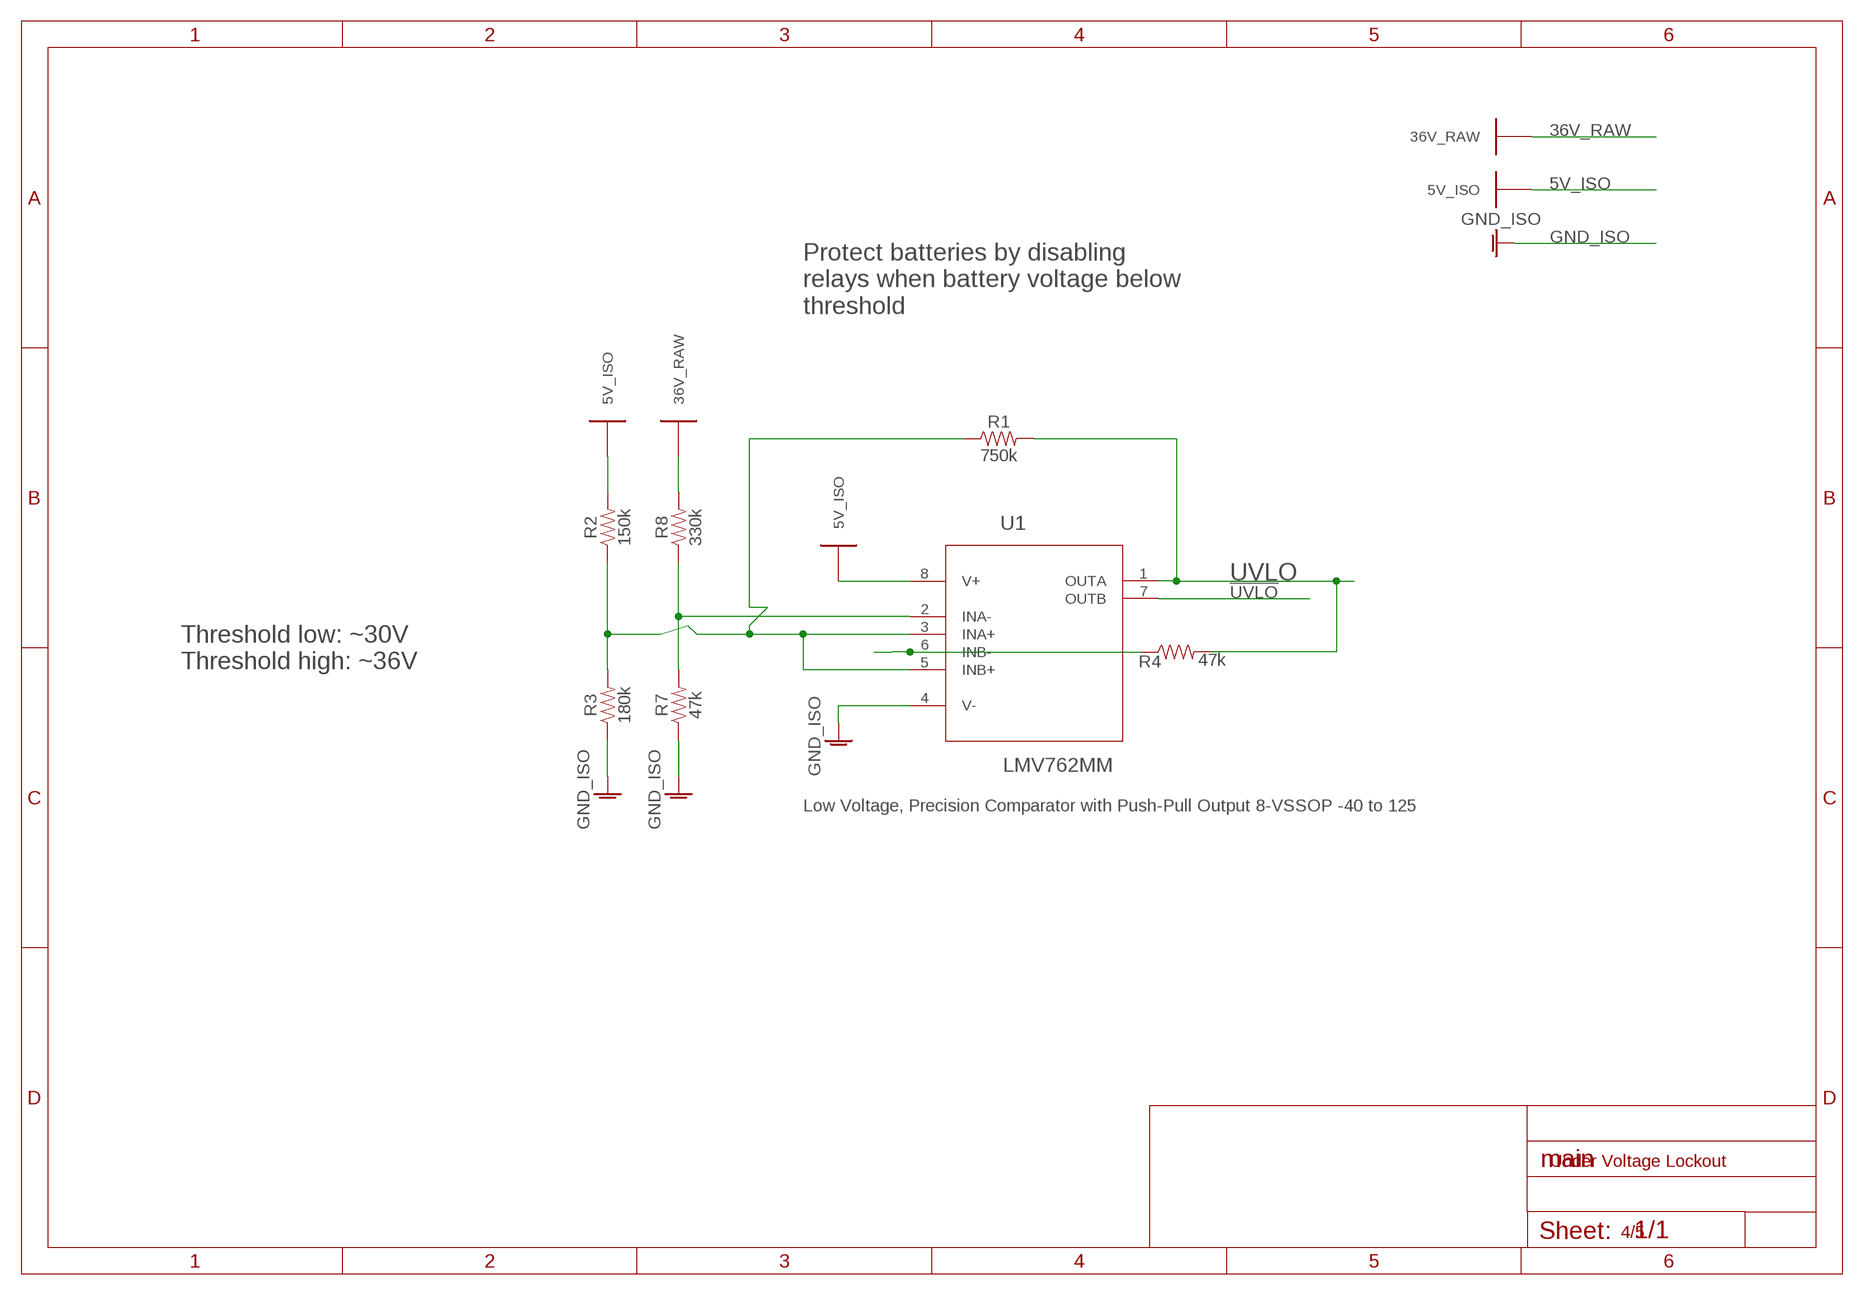
[diagram p10: schematic, module UVLO, sheet 1]

### Parts
R1  750k  750K-0603-1/10W-5%  [0603]
R2  150k  150KOHM-0603-1/10W-1%  [0603]
R3  180k  180KOHM-0603-1/10W-1%  [0603]
R4  47k  47KOHM-0603-1/10W-1%  [0603]
R7  47k  47KOHM-0603-1/10W-1%  [0603]
R8  330k  330KOHM-0603-1/10W-1%  [0603]
U1  LMV762MM  [SOP65P490X110-8N]

### Nets
5V_ISO: R2.2 U1.8(V+)
36V_RAW: R8.2
!UVLO!: U1.7(OUTB)
GND_ISO: R3.1 R7.1 U1.4(V-)
N$2: R4.1 U1.6(INB-)
N$3: R1.1 R2.1 R3.2 U1.3(INA+) U1.5(INB+)
N$4: R7.2 R8.1 U1.2(INA-)
UVLO: R1.2 R4.2 U1.1(OUTA)

### Notes on the sheet
- Protect batteries by disabling
  relays when battery voltage below
  threshold
- Threshold low: ~30V
  Threshold high: ~36V
- Under Voltage Lockout
- 4/5

### Library data of the parts
R1 = passive:750K: 2kΩ resistor A resistor is a passive two-terminal electrical component that implements electrical resistance as a circuit element. Resistors act to reduce current flow, and, at the same time, act to lower voltage levels within circuits. - Wikipedia; DESCRIPTION: RES SMD 750K OHM 1% 1/10W 0603; MANUFACTURER: Yageo; MPN: RC0603FR-07750KL
R2 = passive:150KOHM: 150kΩ resistor A resistor is a passive two-terminal electrical component that implements electrical resistance as a circuit element. Resistors act to reduce current flow, and, at the same time, act to lower voltage levels within circuits. - Wikipedia; DESCRIPTION: RES SMD 150K OHM 1% 1/10W 0603; MANUFACTURER: Yageo; MPN: RC0603FR-07150KL; PROD_ID: RES-09117
R3 = passive:180KOHM: RES-10066; DESCRIPTION: RES SMD 180K OHM 1% 1/10W 0603; MANUFACTURER: Yageo; MPN: RC0603FR-07180KL; PROD_ID: RES-10066
R4 R7 = passive:47KOHM: 47kΩ resistor A resistor is a passive two-terminal electrical component that implements electrical resistance as a circuit element. Resistors act to reduce current flow, and, at the same time, act to lower voltage levels within circuits. - Wikipedia; DESCRIPTION: RES SMD 47K OHM 1% 1/10W 0603; MANUFACTURER: Yageo; MPN: RC0603FR-0747KL; PROD_ID: RES-07871
R8 = passive:330KOHM: 330kΩ resistor A resistor is a passive two-terminal electrical component that implements electrical resistance as a circuit element. Resistors act to reduce current flow, and, at the same time, act to lower voltage levels within circuits. - Wikipedia; DESCRIPTION: RES SMD 330K OHM 1% 1/10W 0603; MANUFACTURER: Yageo; MPN: RC0603FR-07330KL; PROD_ID: RES-08968
U1 = LMV762MM:LMV762MM: Low Voltage, Precision Comparator; AVAILABILITY: Good; DESCRIPTION: Low Voltage, Precision Comparator with Push-Pull Output 8-VSSOP -40 to 125; MANUFACTURER: Texas Instruments; MPN: LMV762MM/NOPB; PACKAGE: MSOP-8 Texas Instruments; PRICE: 1.26 USD

## Module COIL
Ports: RDC+(io) RDC-(io) RMC+(io) RMC-(io) MOW_EN_ISO(pwr) 36V_RAW(pwr) 5V_ISO(pwr) GND_ISO(pwr)
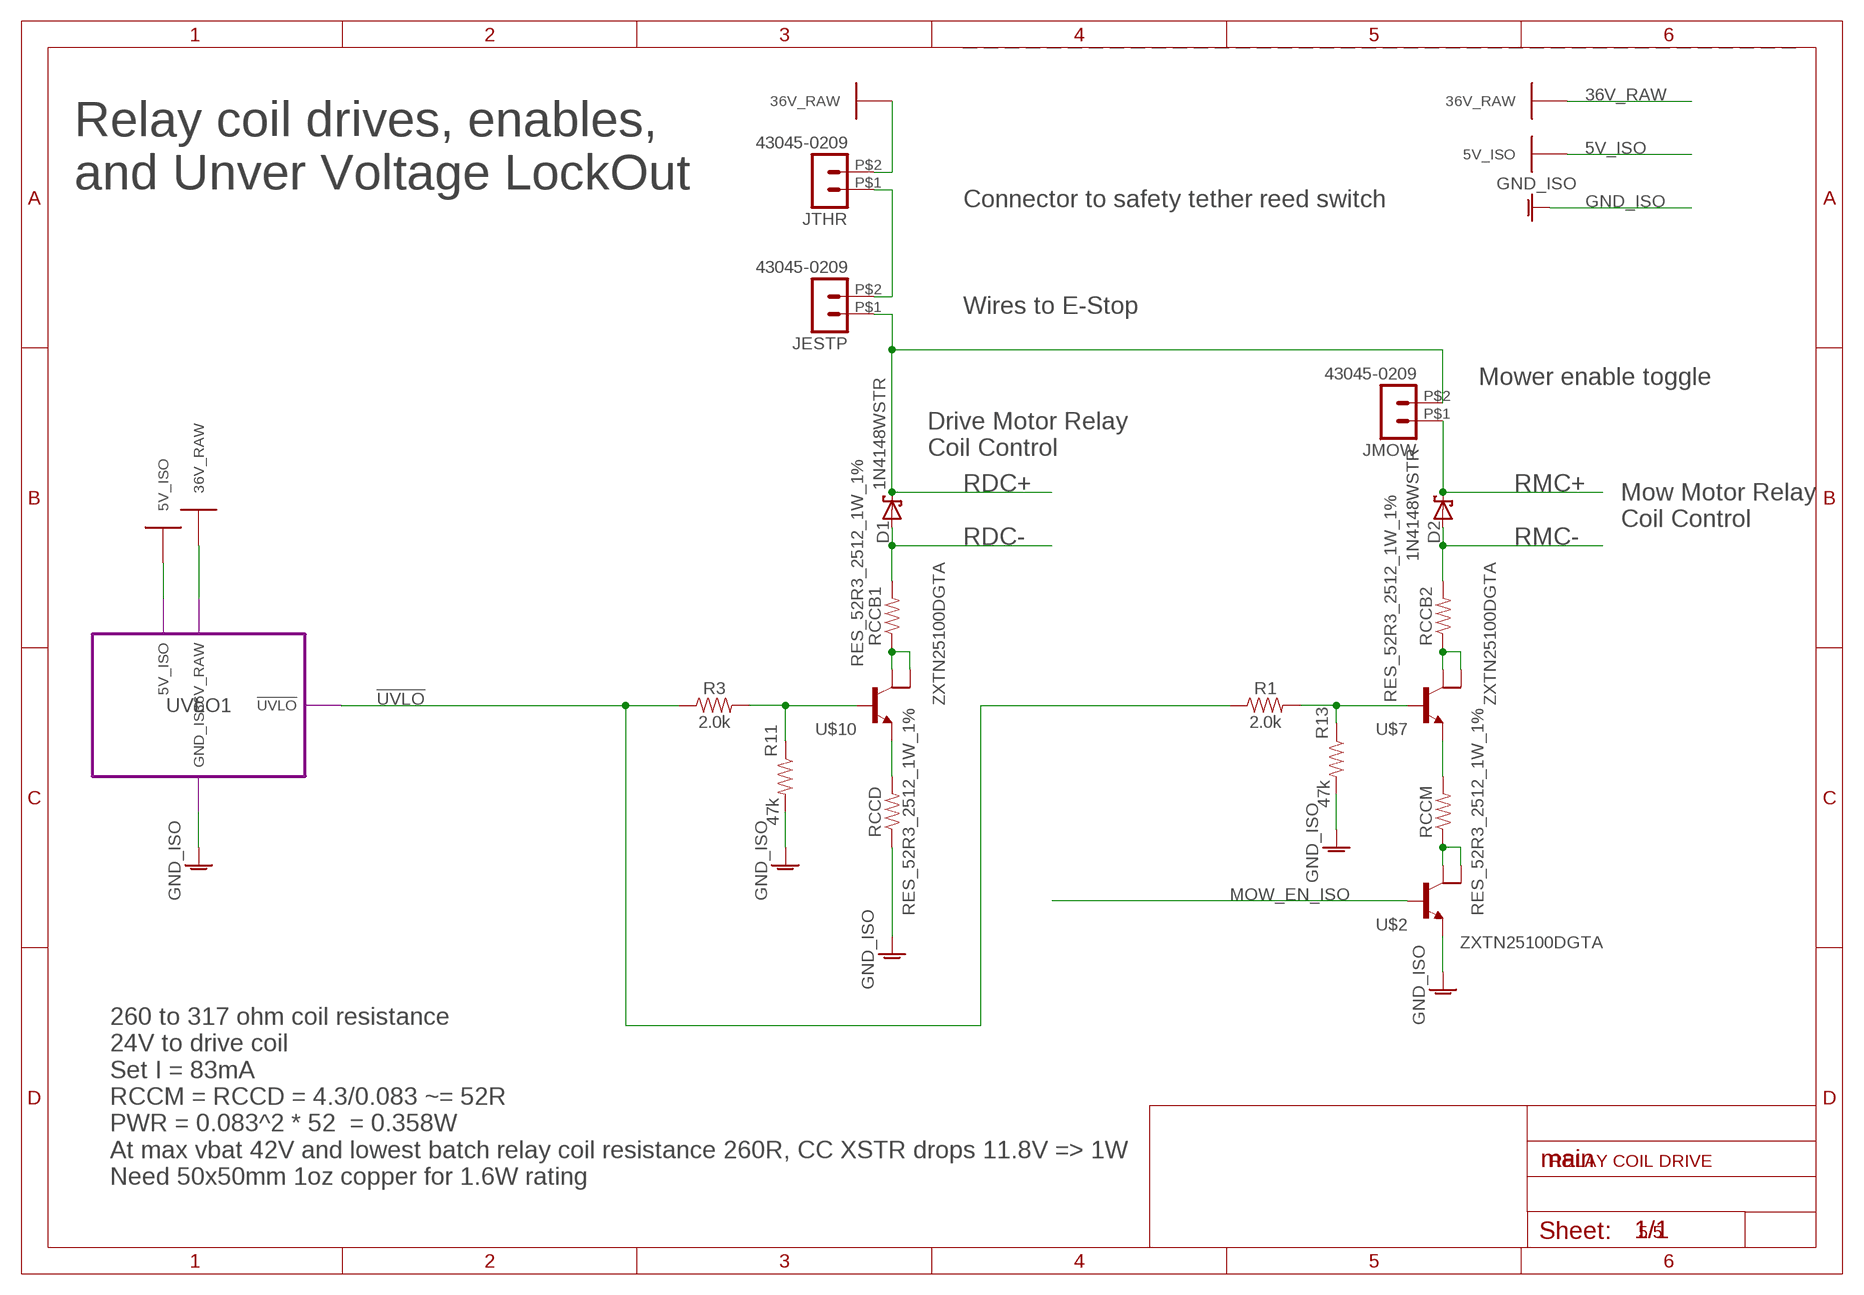
[diagram p11: schematic, module COIL, sheet 1]

### Parts
D1  1N4148WSTR  [SOD323_ST]
D2  1N4148WSTR  [SOD323_ST]
JESTP  43045-0209  HEADER_POS2_43045-0209  [43045-0209]
JMOW  43045-0209  HEADER_POS2_43045-0209  [43045-0209]
JTHR  43045-0209  HEADER_POS2_43045-0209  [43045-0209]
R1  2.0k  2.0KOHM-0603-1/10W-5%  [0603]
R3  2.0k  2.0KOHM-0603-1/10W-5%  [0603]
R11  47k  47KOHM-0603-1/10W-1%  [0603]
R13  47k  47KOHM-0603-1/10W-1%  [0603]
RCCB1  RES_52R3_2512_1W_1%  [R2512]
RCCB2  RES_52R3_2512_1W_1%  [R2512]
RCCD  RES_52R3_2512_1W_1%  [R2512]
RCCM  RES_52R3_2512_1W_1%  [R2512]
U$2  ZXTN25100DGTA  [SOT230P700X160-4N]
U$7  ZXTN25100DGTA  [SOT230P700X160-4N]
U$10  ZXTN25100DGTA  [SOT230P700X160-4N]

### Module instances
UVLO1 = UVLO

### Nets
5V_ISO: port UVLO1.5V_ISO
36V_RAW: JTHR.P$2 ; port UVLO1.36V_RAW
!UVLO!: R1.1 R3.1 ; port UVLO1.!UVLO!
GND_ISO: R11.2 R13.2 RCCD.1 U$2.3(E) ; port UVLO1.GND_ISO
MOW_EN_ISO: U$2.1(B)
N$1: JESTP.P$2 JTHR.P$1
N$2: RCCM.1 U$2.2(C) U$2.4(C2)
N$5: RCCB2.1 U$7.2(C) U$7.4(C2)
N$6: RCCM.2 U$7.3(E)
N$7: R3.2 R11.1 U$10.1(B)
N$9: RCCD.2 U$10.3(E)
N$10: RCCB1.1 U$10.2(C) U$10.4(C2)
N$11: R1.2 R13.1 U$7.1(B)
RDC+: D1.C JESTP.P$1 JMOW.P$2
RDC-: D1.A RCCB1.2
RMC+: D2.C JMOW.P$1
RMC-: D2.A RCCB2.2

### Notes on the sheet
- Relay coil drives, enables,
  and Unver Voltage LockOut
- Connector to safety tether reed switch
- Wires to E-Stop
- Mower enable toggle
- Drive Motor Relay
  Coil Control
- Mow Motor Relay
  Coil Control
- RELAY COIL DRIVE
- 260 to 317 ohm coil resistance
  24V to drive coil
  Set I = 83mA
  RCCM = RCCD = 4.3/0.083 ~= 52R
  PWR = 0.083^2 * 52  = 0.358W 
  At max vbat 42V and lowest batch relay coil resistance 260R, CC XSTR drops 11.8V => 1W
  Need 50x50mm 1oz copper for 1.6W rating
- 5/5

### Library data of the parts
D1 D2 = discrete:1N4148WSTR: Schottky barrier diode Source: www.st.com, BAT60J.pdf; DESCRIPTION: DIODE GEN PURP 75V 300MA SOD323; MANUFACTURER: SMC; MPN: 1N4148WSTR
JESTP = con-molex-micro-fit-3_0:HEADER_POS2_?: Molex - Micro-Fit 3.0 Series connector, 3.00mm (0.118") pitch header, 2 positions.; DESCRIPTION: CONN HEADER 2POS RT ANG SMD TIN; MANUFACTURER: Phoenix Contact; MPN: 43045-0209; SILK: ESTOP
JMOW = con-molex-micro-fit-3_0:HEADER_POS2_?: Molex - Micro-Fit 3.0 Series connector, 3.00mm (0.118") pitch header, 2 positions.; DESCRIPTION: CONN HEADER 2POS RT ANG SMD TIN; MANUFACTURER: Phoenix Contact; MPN: 43045-0209; SILK: MOW
JTHR = con-molex-micro-fit-3_0:HEADER_POS2_?: Molex - Micro-Fit 3.0 Series connector, 3.00mm (0.118") pitch header, 2 positions.; DESCRIPTION: CONN HEADER 2POS RT ANG SMD TIN; MANUFACTURER: Phoenix Contact; MPN: 43045-0209; SILK: TETHER
R1 R3 = passive:2.0KOHM: 2kΩ resistor A resistor is a passive two-terminal electrical component that implements electrical resistance as a circuit element. Resistors act to reduce current flow, and, at the same time, act to lower voltage levels within circuits. - Wikipedia; DESCRIPTION: RES SMD 2K OHM 5% 1/10W 0603; MANUFACTURER: Yageo; MPN: RC0603JR-072KL; PROD_ID: RES-08296
R11 R13 = passive:47KOHM: 47kΩ resistor A resistor is a passive two-terminal electrical component that implements electrical resistance as a circuit element. Resistors act to reduce current flow, and, at the same time, act to lower voltage levels within circuits. - Wikipedia; DESCRIPTION: RES SMD 47K OHM 1% 1/10W 0603; MANUFACTURER: Yageo; MPN: RC0603FR-0747KL; PROD_ID: RES-07871
RCCB1 RCCB2 RCCD RCCM = passive:RES_52R3_2512_1W_1%; DESCRIPTION: RES SMD 52.3 OHM 1% 1W 2512; MANUFACTURER: Rohm; MPN: MCR100JZHF52R3
U$2 U$7 U$10 = discrete:ZXTN25100DGTA; DESCRIPTION: TRANS NPN 100V 3A SOT223; MANUFACTURER: Diodes Inc; MPN: ZXTN25100DGTA

## Module RL
Ports: 36V(pwr) GND(pwr) MOW_EN(io) VSENSE(io) 5V(pwr) 5V_ISO(pwr) GND_ISO(pwr)
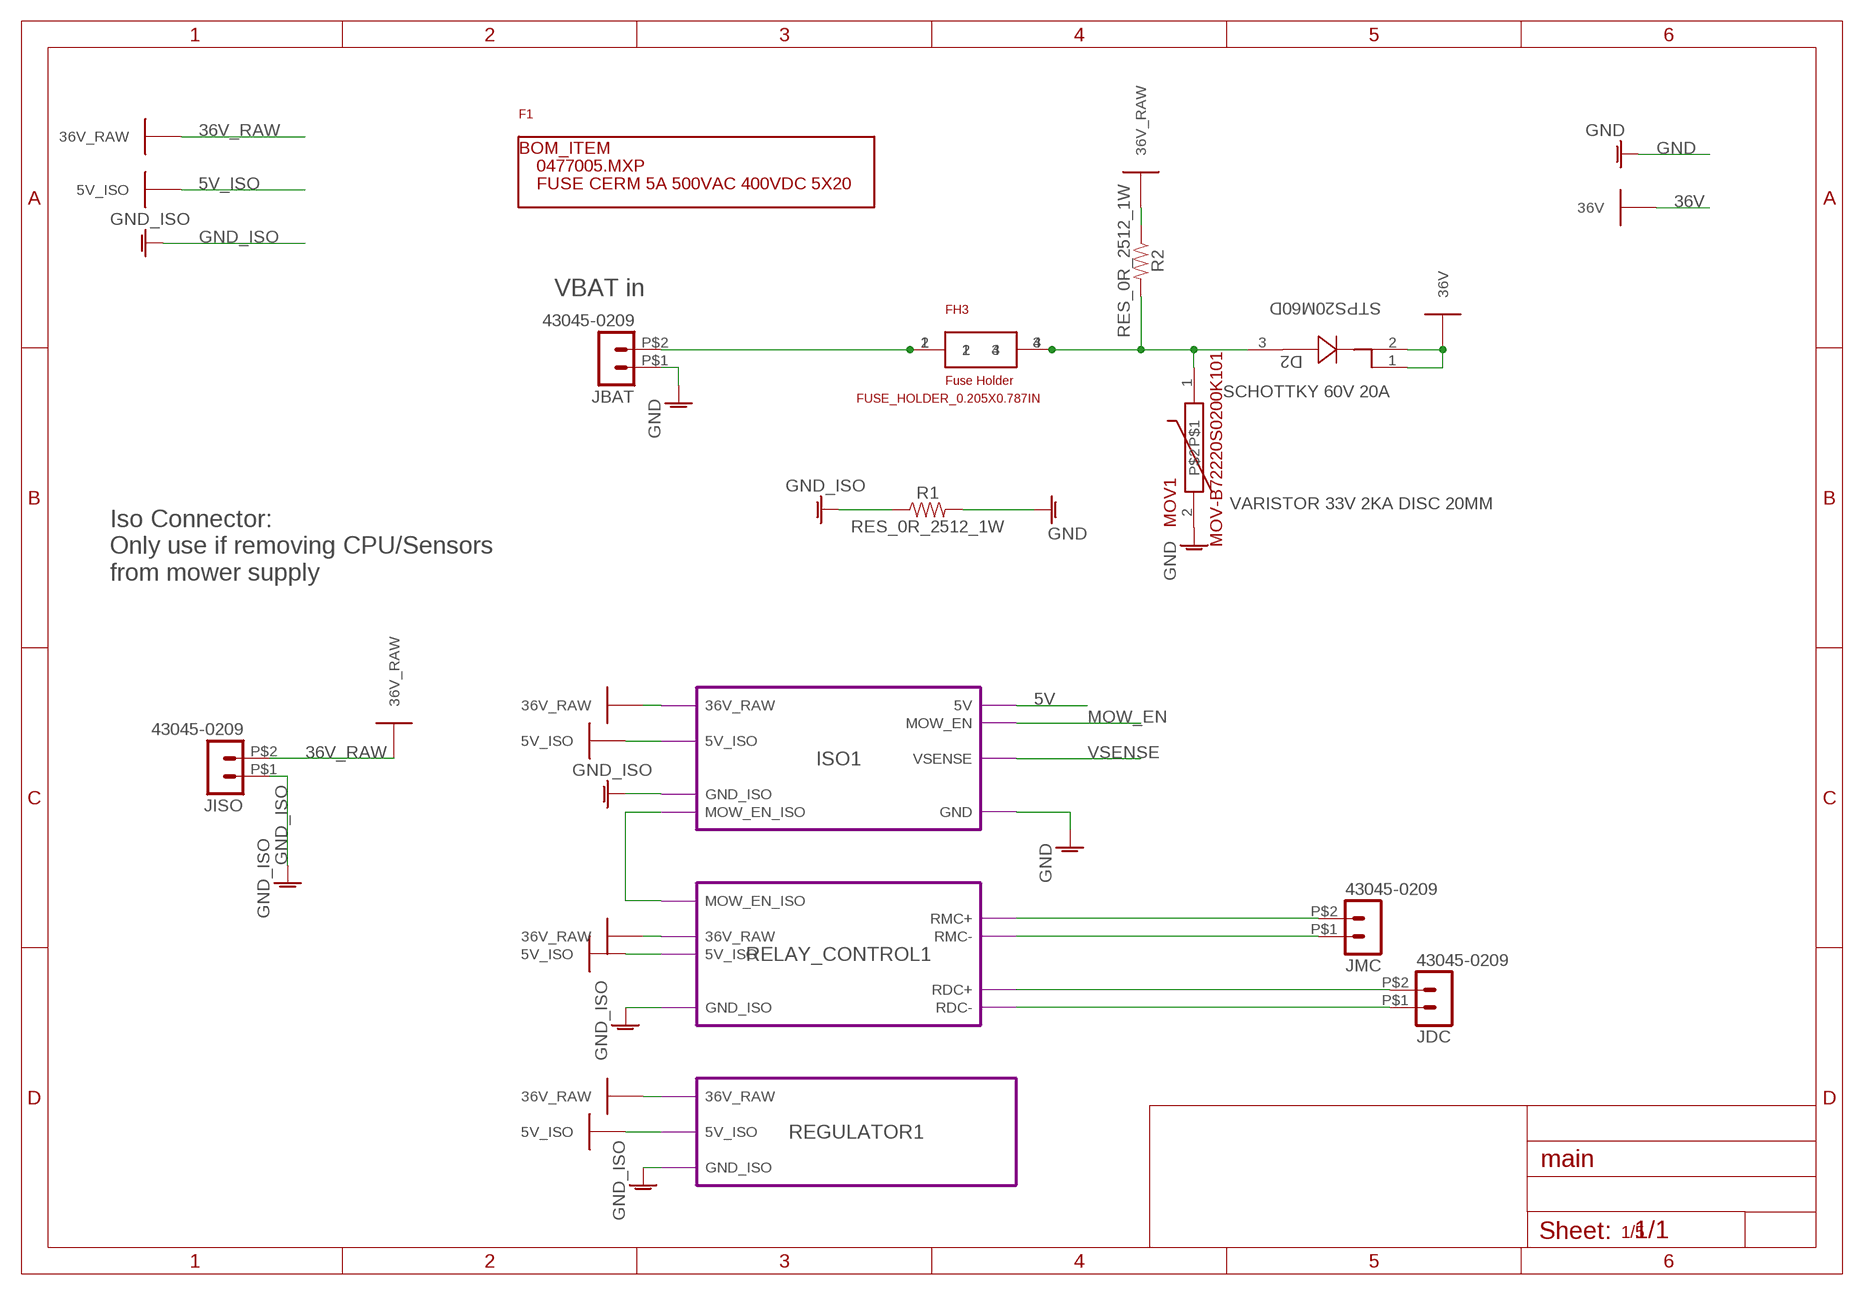
[diagram p12: schematic, module RL, sheet 1]
F1 (BOMFUSE_0477005.MXP): DESCRIPTION: FUSE CERM 5A 500VAC 400VDC 5X20; MANUFACTURER: Littelfuse; MPN: 0477005.MXP

### Parts
D2  STPS20M60D  [TO220AC]
FH3  FUSE_HOLDER_0.205X0.787IN  [LF445_0.807IN]
JBAT  43045-0209  HEADER_POS2_43045-0209  [43045-0209]
JDC  43045-0209  HEADER_POS2_43045-0209  [43045-0209]
JISO  43045-0209  HEADER_POS2_43045-0209  [43045-0209]
JMC  43045-0209  HEADER_POS2_43045-0209  [43045-0209]
MOV1  MOV-B72220S0200K101  [S20K440]
R1  RES_0R_2512_1W  [R2512]
R2  RES_0R_2512_1W  [R2512]

### Module instances
RELAY_CONTROL1 = COIL
REGULATOR1 = REG
ISO1 = ISO

### Nets
5V: port ISO1.5V
5V_ISO: port ISO1.5V_ISO RELAY_CONTROL1.5V_ISO REGULATOR1.5V_ISO
36V: D2.1 D2.2
36V_RAW: JISO.P$2 R2.1 ; port ISO1.36V_RAW RELAY_CONTROL1.36V_RAW REGULATOR1.36V_RAW
GND: JBAT.P$1 MOV1.2 R1.2 ; port ISO1.GND
GND_ISO: JISO.P$1 R1.1 ; port ISO1.GND_ISO REGULATOR1.GND_ISO RELAY_CONTROL1.GND_ISO
MOW_EN: port ISO1.MOW_EN
N$1: FH3.1 FH3.2 JBAT.P$2
N$2: JMC.P$2 ; port RELAY_CONTROL1.RMC+
N$3: JDC.P$2 ; port RELAY_CONTROL1.RDC+
N$4: JMC.P$1 ; port RELAY_CONTROL1.RMC-
N$5: port RELAY_CONTROL1.MOW_EN_ISO ISO1.MOW_EN_ISO
N$6: JDC.P$1 ; port RELAY_CONTROL1.RDC-
N$11: D2.3 FH3.3 FH3.4 MOV1.1 R2.2
VSENSE: port ISO1.VSENSE

### Notes on the sheet
- VBAT in
- Iso Connector:
  Only use if removing CPU/Sensors
  from mower supply
- 1/5

### Library data of the parts
D2 = discrete:STPS20M60D; DESCRIPTION: SCHOTTKY 60V 20A; MANUFACTURER: STMicroelectronics; MPN: STPS20M60D
FH3 = power_supplies:FUSE_HOLDER_0.205X0.787IN; DESCRIPTION: 2x FUSE CLIP CARTRIDGE 600V 20A PCB; MANUFACTURER: LittelFuse; MPN: 01000020Z
JBAT = con-molex-micro-fit-3_0:HEADER_POS2_?: Molex - Micro-Fit 3.0 Series connector, 3.00mm (0.118") pitch header, 2 positions.; DESCRIPTION: CONN HEADER 2POS RT ANG SMD TIN; MANUFACTURER: Phoenix Contact; MPN: 43045-0209; SILK: BAT
JDC = con-molex-micro-fit-3_0:HEADER_POS2_?: Molex - Micro-Fit 3.0 Series connector, 3.00mm (0.118") pitch header, 2 positions.; DESCRIPTION: CONN HEADER 2POS RT ANG SMD TIN; MANUFACTURER: Phoenix Contact; MPN: 43045-0209; SILK: DRIVE_REL
JISO = con-molex-micro-fit-3_0:HEADER_POS2_?: Molex - Micro-Fit 3.0 Series connector, 3.00mm (0.118") pitch header, 2 positions.; DESCRIPTION: CONN HEADER 2POS RT ANG SMD TIN; MANUFACTURER: Phoenix Contact; MPN: 43045-0209; SILK: ISO
JMC = con-molex-micro-fit-3_0:HEADER_POS2_?: Molex - Micro-Fit 3.0 Series connector, 3.00mm (0.118") pitch header, 2 positions.; DESCRIPTION: CONN HEADER 2POS RT ANG SMD TIN; MANUFACTURER: Phoenix Contact; MPN: 43045-0209; SILK: MOW_REL
MOV1 = power_supplies:MOV-B72220S0200K101; DESCRIPTION: VARISTOR 33V 2KA DISC 20MM; MANUFACTURER: EPCOS; MPN: B72220S0200K101
R1 R2 = passive:RES_0R_2512_1W; DESCRIPTION: RES SMD 0 OHM JUMPER 1W 2512; MANUFACTURER: Yageo; MPN: RC2512JK-070RL

## Module SNS
Ports: 5V(pwr) GND(pwr) REACH_RX(io) REACH_TX(io) IMU_SCL(io) IMU_SDA(io) MOTOR_L_CHANNEL_A(io) MOTOR_L_CHANNEL_B(io) MOTOR_R_CHANNEL_A(io) MOTOR_R_CHANNEL_B(io) 3V3(pwr)
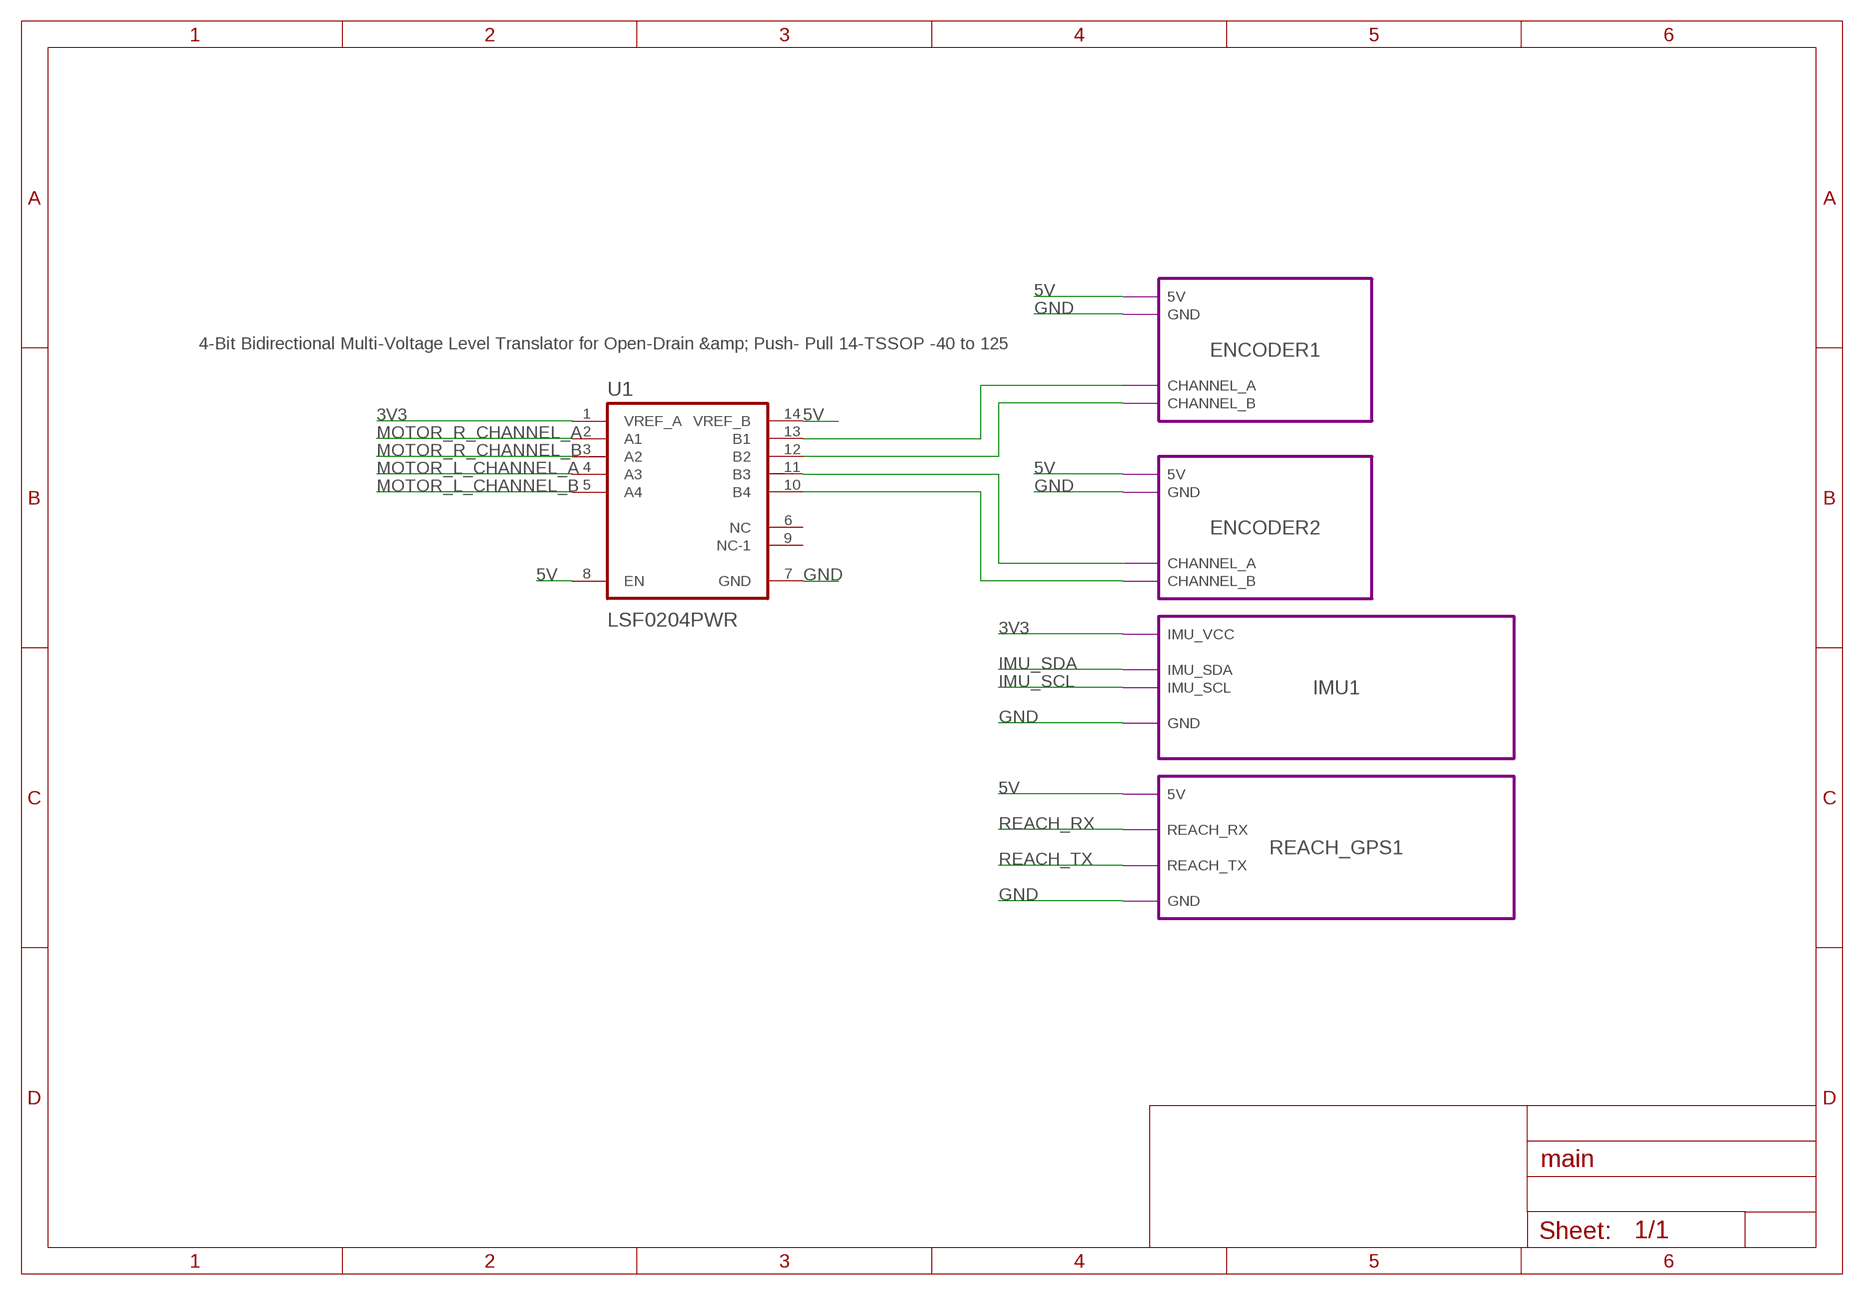
[diagram p13: schematic, module SNS, sheet 1]

### Parts
U1  LSF0204PWR  [SOP65P640X120-14N]

### Module instances
IMU1 = IMU
REACH_GPS1 = RCH
ENCODER1 = ENC
ENCODER2 = ENC

### Nets
3V3: U1.1(VREF_A) ; port IMU1.IMU_VCC
5V: U1.8(EN) U1.14(VREF_B) ; port REACH_GPS1.5V ENCODER1.5V ENCODER2.5V
GND: U1.7(GND) ; port IMU1.GND REACH_GPS1.GND ENCODER1.GND ENCODER2.GND
IMU_SCL: port IMU1.IMU_SCL
IMU_SDA: port IMU1.IMU_SDA
MOTOR_L_CHANNEL_A: U1.4(A3)
MOTOR_L_CHANNEL_B: U1.5(A4)
MOTOR_R_CHANNEL_A: U1.2(A1)
MOTOR_R_CHANNEL_B: U1.3(A2)
N$1: U1.13(B1) ; port ENCODER1.CHANNEL_A
N$2: U1.12(B2) ; port ENCODER1.CHANNEL_B
N$3: U1.11(B3) ; port ENCODER2.CHANNEL_A
N$4: U1.10(B4) ; port ENCODER2.CHANNEL_B
REACH_RX: port REACH_GPS1.REACH_RX
REACH_TX: port REACH_GPS1.REACH_TX
Unconnected: U1.6(NC) U1.9(NC-1)

### Library data of the parts
U1 = LSF0204PWR:LSF0204PWR: None; AVAILABILITY: Good; DESCRIPTION: 4-Bit Bidirectional Multi-Voltage Level Translator for Open-Drain &amp; Push- Pull 14-TSSOP -40 to 125; MANUFACTURER: Texas Instruments; MPN: LSF0204PWR; PACKAGE: TSSOP-14 Texas Instruments; PRICE: 0.62 USD

## Module TX2
Ports: GND(io) UART1_RXD_HDR_3V3(io) UART1_TXD_HDR_3V3(io) I2C_GP0_SCL_3V3_LVL(io) I2C_GP0_SDA_3V3_LVL(io)
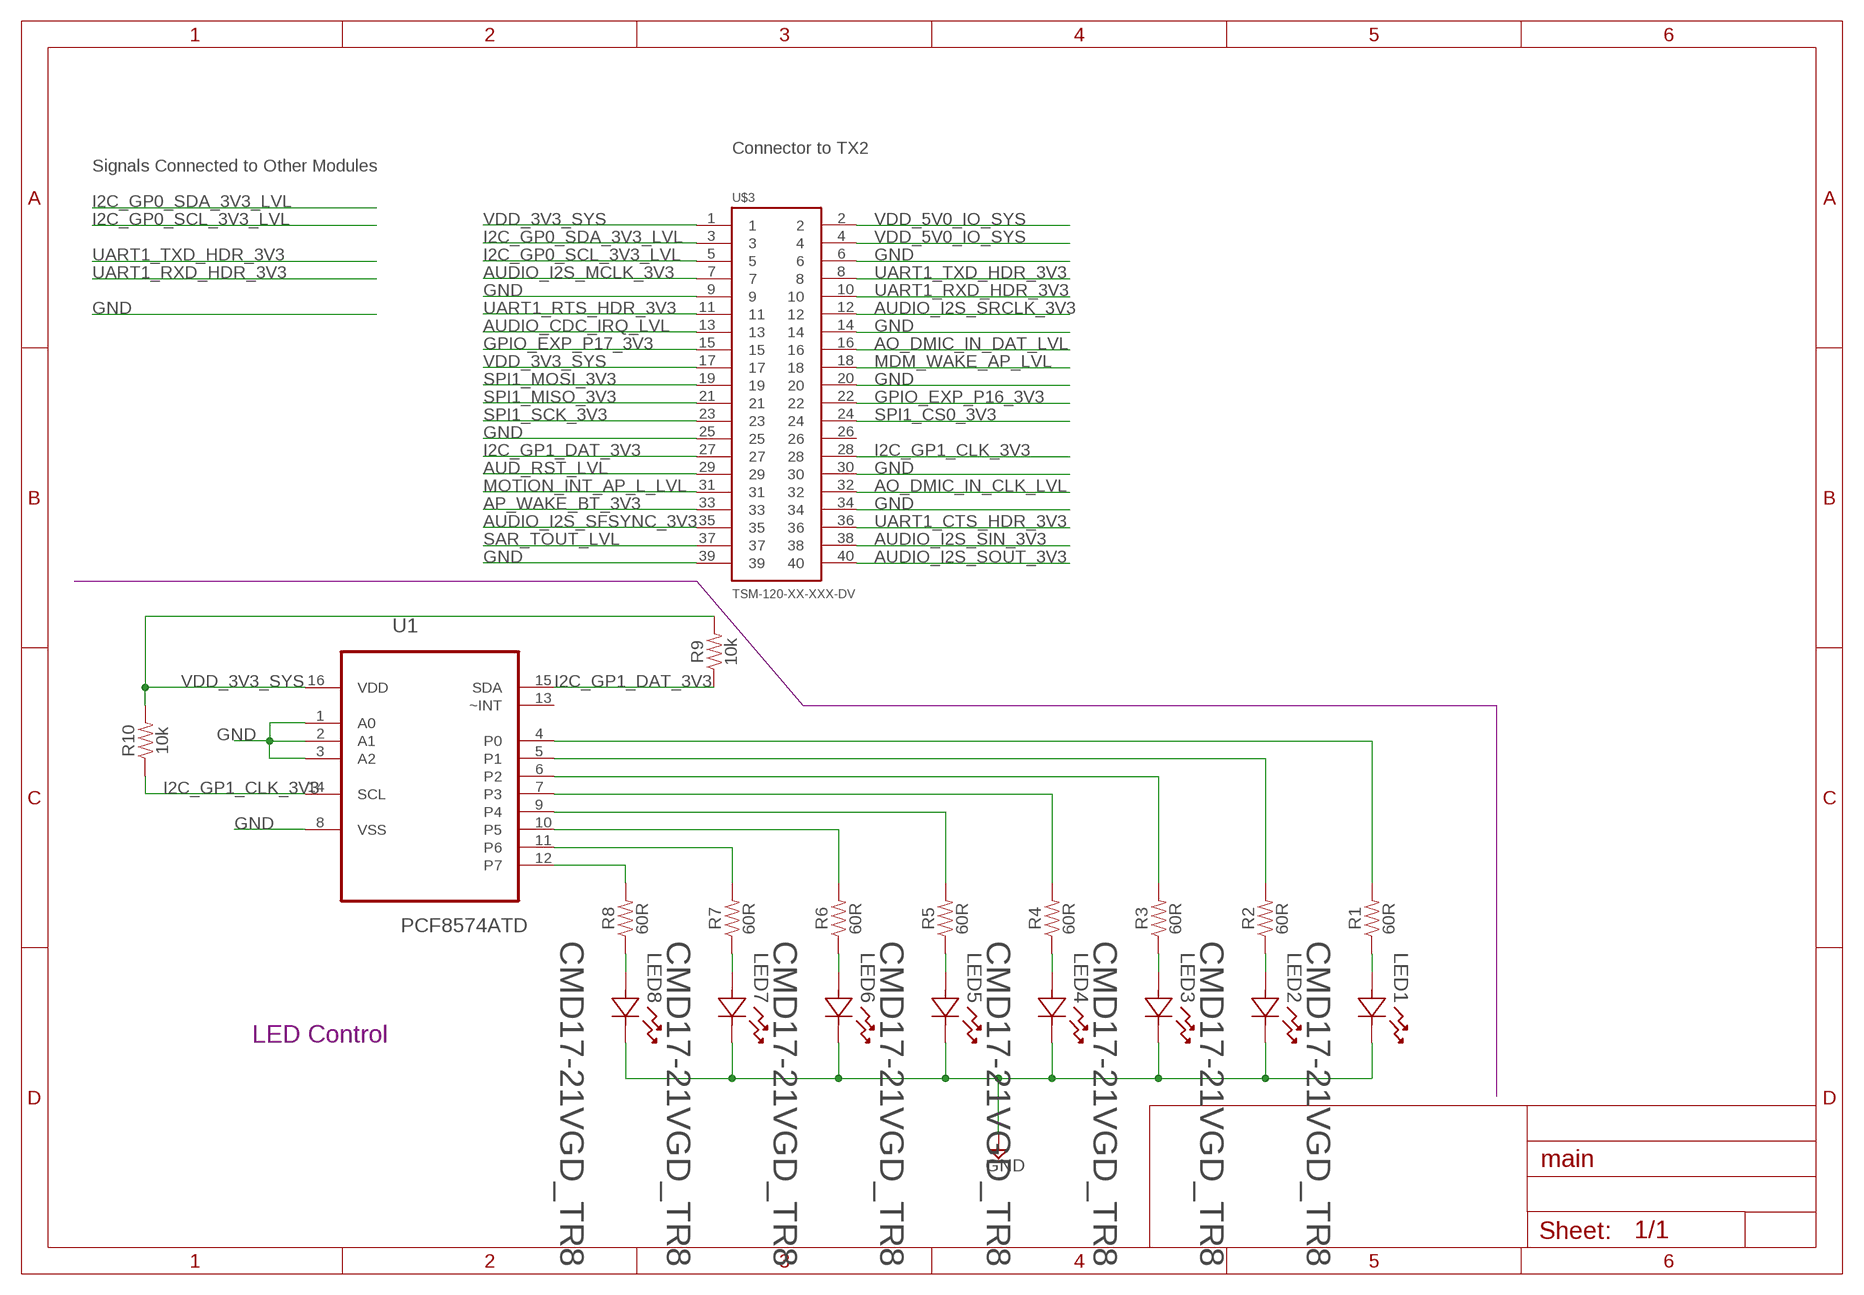
[diagram p14: schematic, module TX2, sheet 1]

### Parts
LED1  CMD17-21VGD_TR8  [LED_CMD17-21VGD_TR8]
LED2  CMD17-21VGD_TR8  [LED_CMD17-21VGD_TR8]
LED3  CMD17-21VGD_TR8  [LED_CMD17-21VGD_TR8]
LED4  CMD17-21VGD_TR8  [LED_CMD17-21VGD_TR8]
LED5  CMD17-21VGD_TR8  [LED_CMD17-21VGD_TR8]
LED6  CMD17-21VGD_TR8  [LED_CMD17-21VGD_TR8]
LED7  CMD17-21VGD_TR8  [LED_CMD17-21VGD_TR8]
LED8  CMD17-21VGD_TR8  [LED_CMD17-21VGD_TR8]
R1  60R  60OHM-0603-1/10W-5%  [0603]
R2  60R  60OHM-0603-1/10W-5%  [0603]
R3  60R  60OHM-0603-1/10W-5%  [0603]
R4  60R  60OHM-0603-1/10W-5%  [0603]
R5  60R  60OHM-0603-1/10W-5%  [0603]
R6  60R  60OHM-0603-1/10W-5%  [0603]
R7  60R  60OHM-0603-1/10W-5%  [0603]
R8  60R  60OHM-0603-1/10W-5%  [0603]
R9  10k  10KOHM-0603-1/10W-5%  [0603]
R10  10k  10KOHM-0603-1/10W-5%  [0603]
U1  PCF8574ATD  [SOIC127P1032X265-16N]
U$3  TSM-120-XX-XXX-DV  [TSM-120-XX-XXX-D]

### Nets
AO_DMIC_IN_CLK_LVL: U$3.32
AO_DMIC_IN_DAT_LVL: U$3.16
AP_WAKE_BT_3V3: U$3.33
AUD_RST_LVL: U$3.29
AUDIO_CDC_IRQ_LVL: U$3.13
AUDIO_I2S_MCLK_3V3: U$3.7
AUDIO_I2S_SFSYNC_3V3: U$3.35
AUDIO_I2S_SIN_3V3: U$3.38
AUDIO_I2S_SOUT_3V3: U$3.40
AUDIO_I2S_SRCLK_3V3: U$3.12
GND: LED1.2 LED2.2 LED3.2 LED4.2 LED5.2 LED6.2 LED7.2 LED8.2 U1.1(A0) U1.2(A1) U1.3(A2) U1.8(VSS) U$3.6 U$3.9 U$3.14 U$3.20 U$3.25 U$3.30 U$3.34 U$3.39
GPIO_EXP_P16_3V3: U$3.22
GPIO_EXP_P17_3V3: U$3.15
I2C_GP0_SCL_3V3_LVL: U$3.5
I2C_GP0_SDA_3V3_LVL: U$3.3
I2C_GP1_CLK_3V3: R10.1 U1.14(SCL) U$3.28
I2C_GP1_DAT_3V3: R9.1 U1.15(SDA) U$3.27
MDM_WAKE_AP_LVL: U$3.18
MOTION_INT_AP_L_LVL: U$3.31
N$1: LED8.1 R8.1
N$2: LED7.1 R7.1
N$3: LED6.1 R6.1
N$4: LED5.1 R5.1
N$5: LED4.1 R4.1
N$6: LED3.1 R3.1
N$7: LED2.1 R2.1
N$8: LED1.1 R1.1
N$9: R8.2 U1.12(P7)
N$10: R7.2 U1.11(P6)
N$11: R6.2 U1.10(P5)
N$12: R5.2 U1.9(P4)
N$13: R4.2 U1.7(P3)
N$14: R3.2 U1.6(P2)
N$15: R2.2 U1.5(P1)
N$16: R1.2 U1.4(P0)
SAR_TOUT_LVL: U$3.37
SPI1_CS0_3V3: U$3.24
SPI1_MISO_3V3: U$3.21
SPI1_MOSI_3V3: U$3.19
SPI1_SCK_3V3: U$3.23
UART1_CTS_HDR_3V3: U$3.36
UART1_RTS_HDR_3V3: U$3.11
UART1_RXD_HDR_3V3: U$3.10
UART1_TXD_HDR_3V3: U$3.8
VDD_3V3_SYS: R9.2 R10.2 U1.16(VDD) U$3.1 U$3.17
VDD_5V0_IO_SYS: U$3.2 U$3.4
Unconnected: U1.13(~INT) U$3.26

### Notes on the sheet
- Connector to TX2
- Signals Connected to Other Modules
- LED Control

### Library data of the parts
LED1-LED8 = CMD17-21VGD_TR8:CMD17-21VGD_TR8: LED, GREEN, 7MCD, 570NM; AVAILABILITY: Good; DESCRIPTION: Led, Green, 1.25mm x 1.4mm, 7mcd, 570nm, Full Reel; MANUFACTURER: Chicago Miniature Lighting; MPN: CMD17-21VGD/TR8; PACKAGE: 0805 Chicago Miniature Lighting; PRICE: 0.18 USD
R1-R8 = passive:60OHM: 2kΩ resistor A resistor is a passive two-terminal electrical component that implements electrical resistance as a circuit element. Resistors act to reduce current flow, and, at the same time, act to lower voltage levels within circuits. - Wikipedia; DESCRIPTION: RES SMD 60.4 OHM 1% 1/10W 0603; MANUFACTURER: Yageo; MPN: RC0603FR-0760R4L
R9 R10 = passive:10KOHM: 2kΩ resistor A resistor is a passive two-terminal electrical component that implements electrical resistance as a circuit element. Resistors act to reduce current flow, and, at the same time, act to lower voltage levels within circuits. - Wikipedia; DESCRIPTION: RES SMD 10K OHM 1% 1/10W 0603; MANUFACTURER: Yageo; MPN: RC0603FR-0710KL
U1 = PCF8574ATD:PCF8574ATD: Remote 8-bit I/O expander for I2C-bus; AVAILABILITY: Unavailable; DESCRIPTION: Smt t/r; MANUFACTURER: NXP Semiconductors; MPN: PCF8574ATD-T; PACKAGE: SOIC-16 NXP Semiconductors; PRICE: 1.10 USD
U$3 = TSM-120-XX-XXX-DV:TSM-120-XX-XXX-DV: .100" (2,54mm) Surface Mount, Double Row, Vertical Mount. manufacturer:SAMTEC; DESCRIPTION: CONN HEADER 30POS SMT VERT 30AU; MANUFACTURER: 3M; MPN: N2530-6V0C-RB-WF; SILK: TX2_J21

## Module JETSON
Ports: GND(pwr) DUE_TO_TX2(io) TX2_TO_DUE(io) UART0_RX(io) UART0_TX(io) I2C0_SCL(io) I2C0_SDA(io) 12V(io)
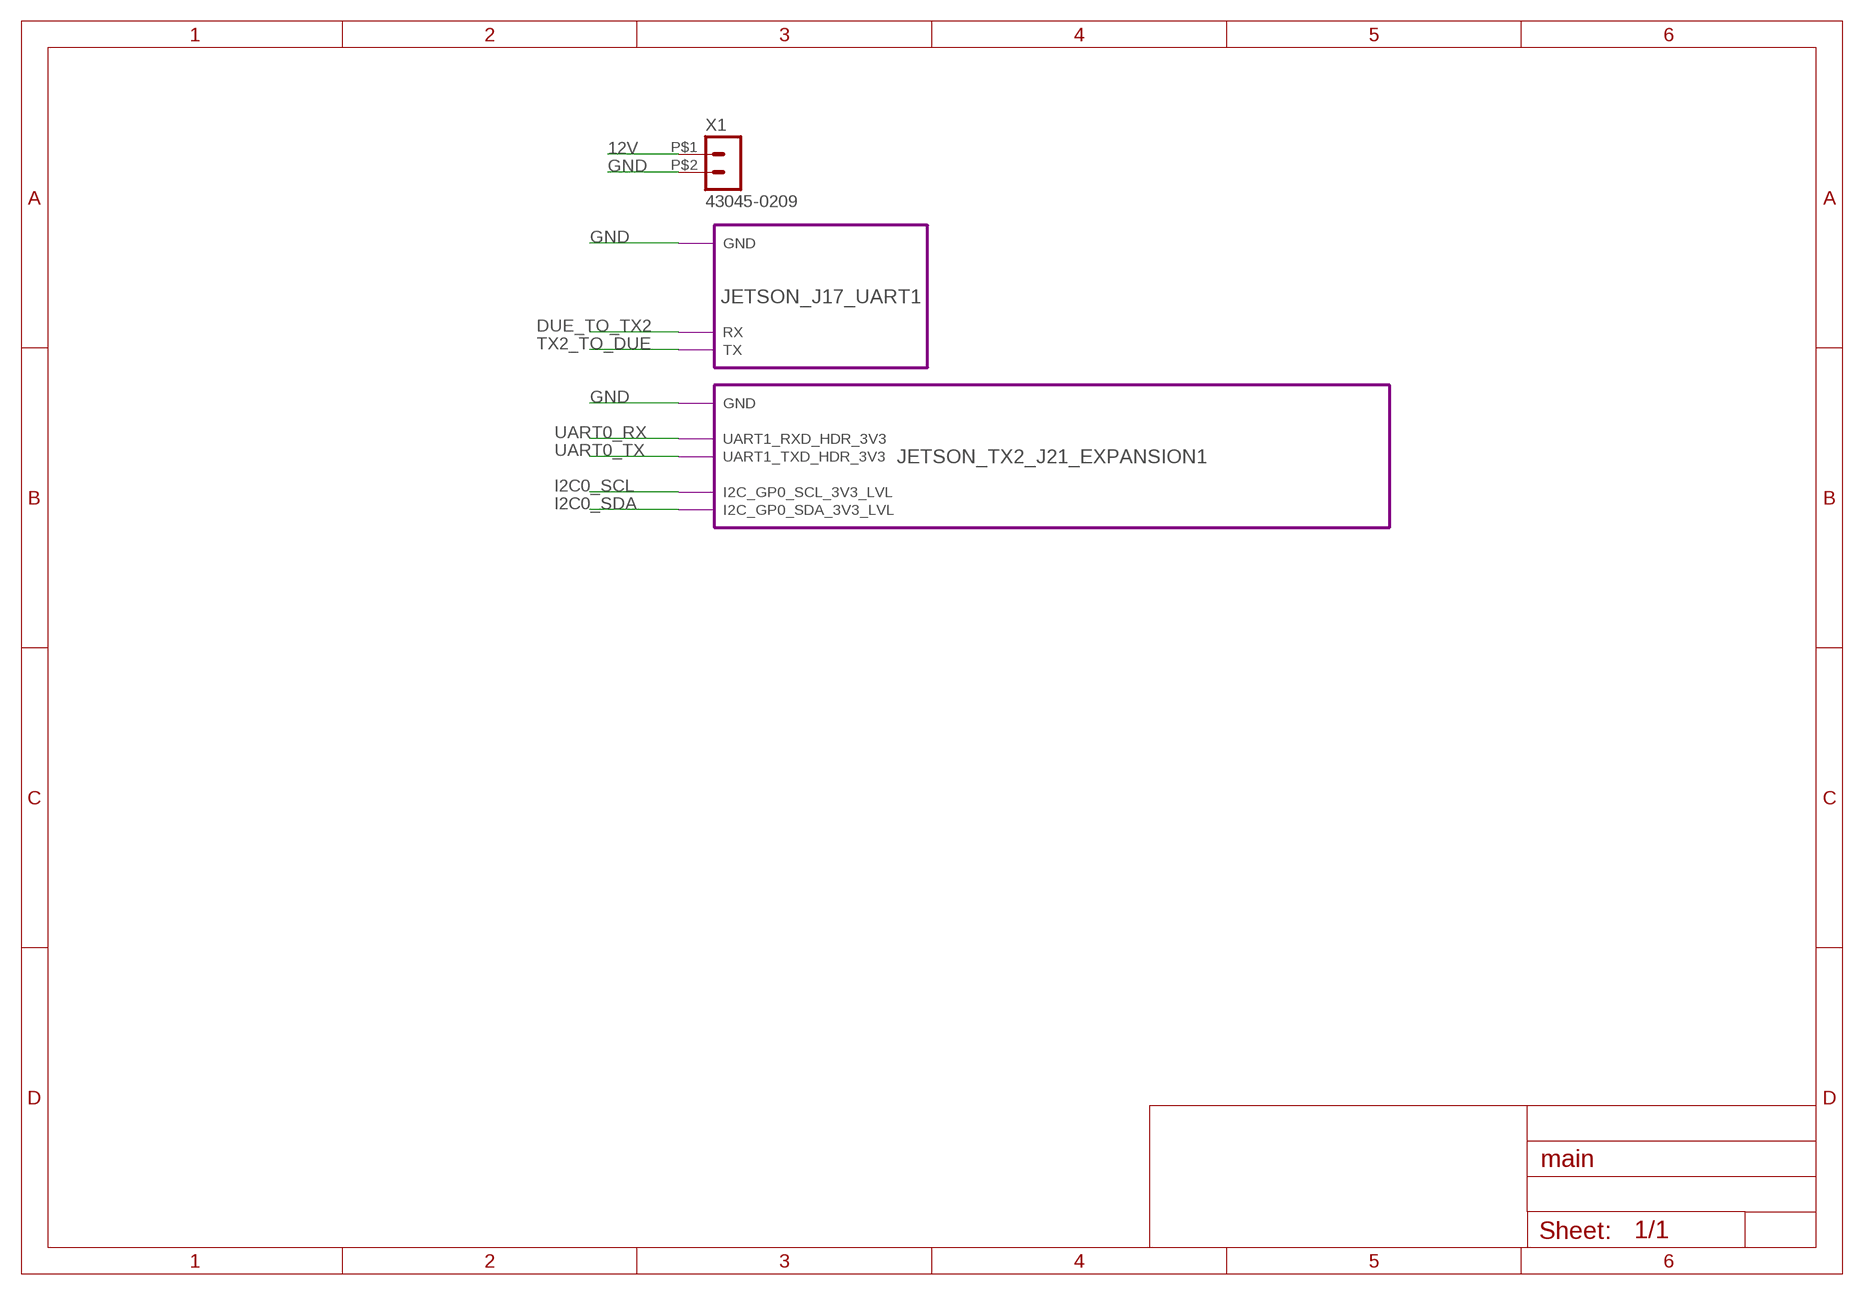
[diagram p15: schematic, module JETSON, sheet 1]

### Parts
X1  43045-0209  HEADER_POS2_43045-0209  [43045-0209]

### Module instances
JETSON_J17_UART1 = URT
JETSON_TX2_J21_EXPANSION1 = TX2

### Nets
12V: X1.P$1
DUE_TO_TX2: port JETSON_J17_UART1.RX
GND: X1.P$2 ; port JETSON_J17_UART1.GND JETSON_TX2_J21_EXPANSION1.GND
I2C0_SCL: port JETSON_TX2_J21_EXPANSION1.I2C_GP0_SCL_3V3_LVL
I2C0_SDA: port JETSON_TX2_J21_EXPANSION1.I2C_GP0_SDA_3V3_LVL
TX2_TO_DUE: port JETSON_J17_UART1.TX
UART0_RX: port JETSON_TX2_J21_EXPANSION1.UART1_RXD_HDR_3V3
UART0_TX: port JETSON_TX2_J21_EXPANSION1.UART1_TXD_HDR_3V3

### Library data of the parts
X1 = con-molex-micro-fit-3_0:HEADER_POS2_?: Molex - Micro-Fit 3.0 Series connector, 3.00mm (0.118") pitch header, 2 positions.; DESCRIPTION: CONN HEADER 2POS RT ANG SMD TIN; MANUFACTURER: Phoenix Contact; MPN: 43045-0209

## Module MTR
Ports: GND(pwr) PWM_A_1(io) PWM_B_1(io) ENABLE_1(io) CURRENT_SENSE_1(io) PWM_A_2(io) PWM_B_2(io) ENABLE_2(io) CURRENT_SENSE_2(io) DECK_1_IN_1(io) DECK_1_IN_2(io) DECK_1_PWM(io) DECK_1_CURR_SENSE(io) DECK_1_POS_SENSE(io) DECK_2_IN_1(io) DECK_2_IN_2(io) DECK_2_PWM(io) DECK_2_CURR_SENSE(io) DECK_2_POS_SENSE(io) DECK_3_IN_1(io) DECK_3_IN_2(io) DECK_3_PWM(io) DECK_3_CURR_SENSE(io) DECK_3_POS_SENSE(io) 5V(io)
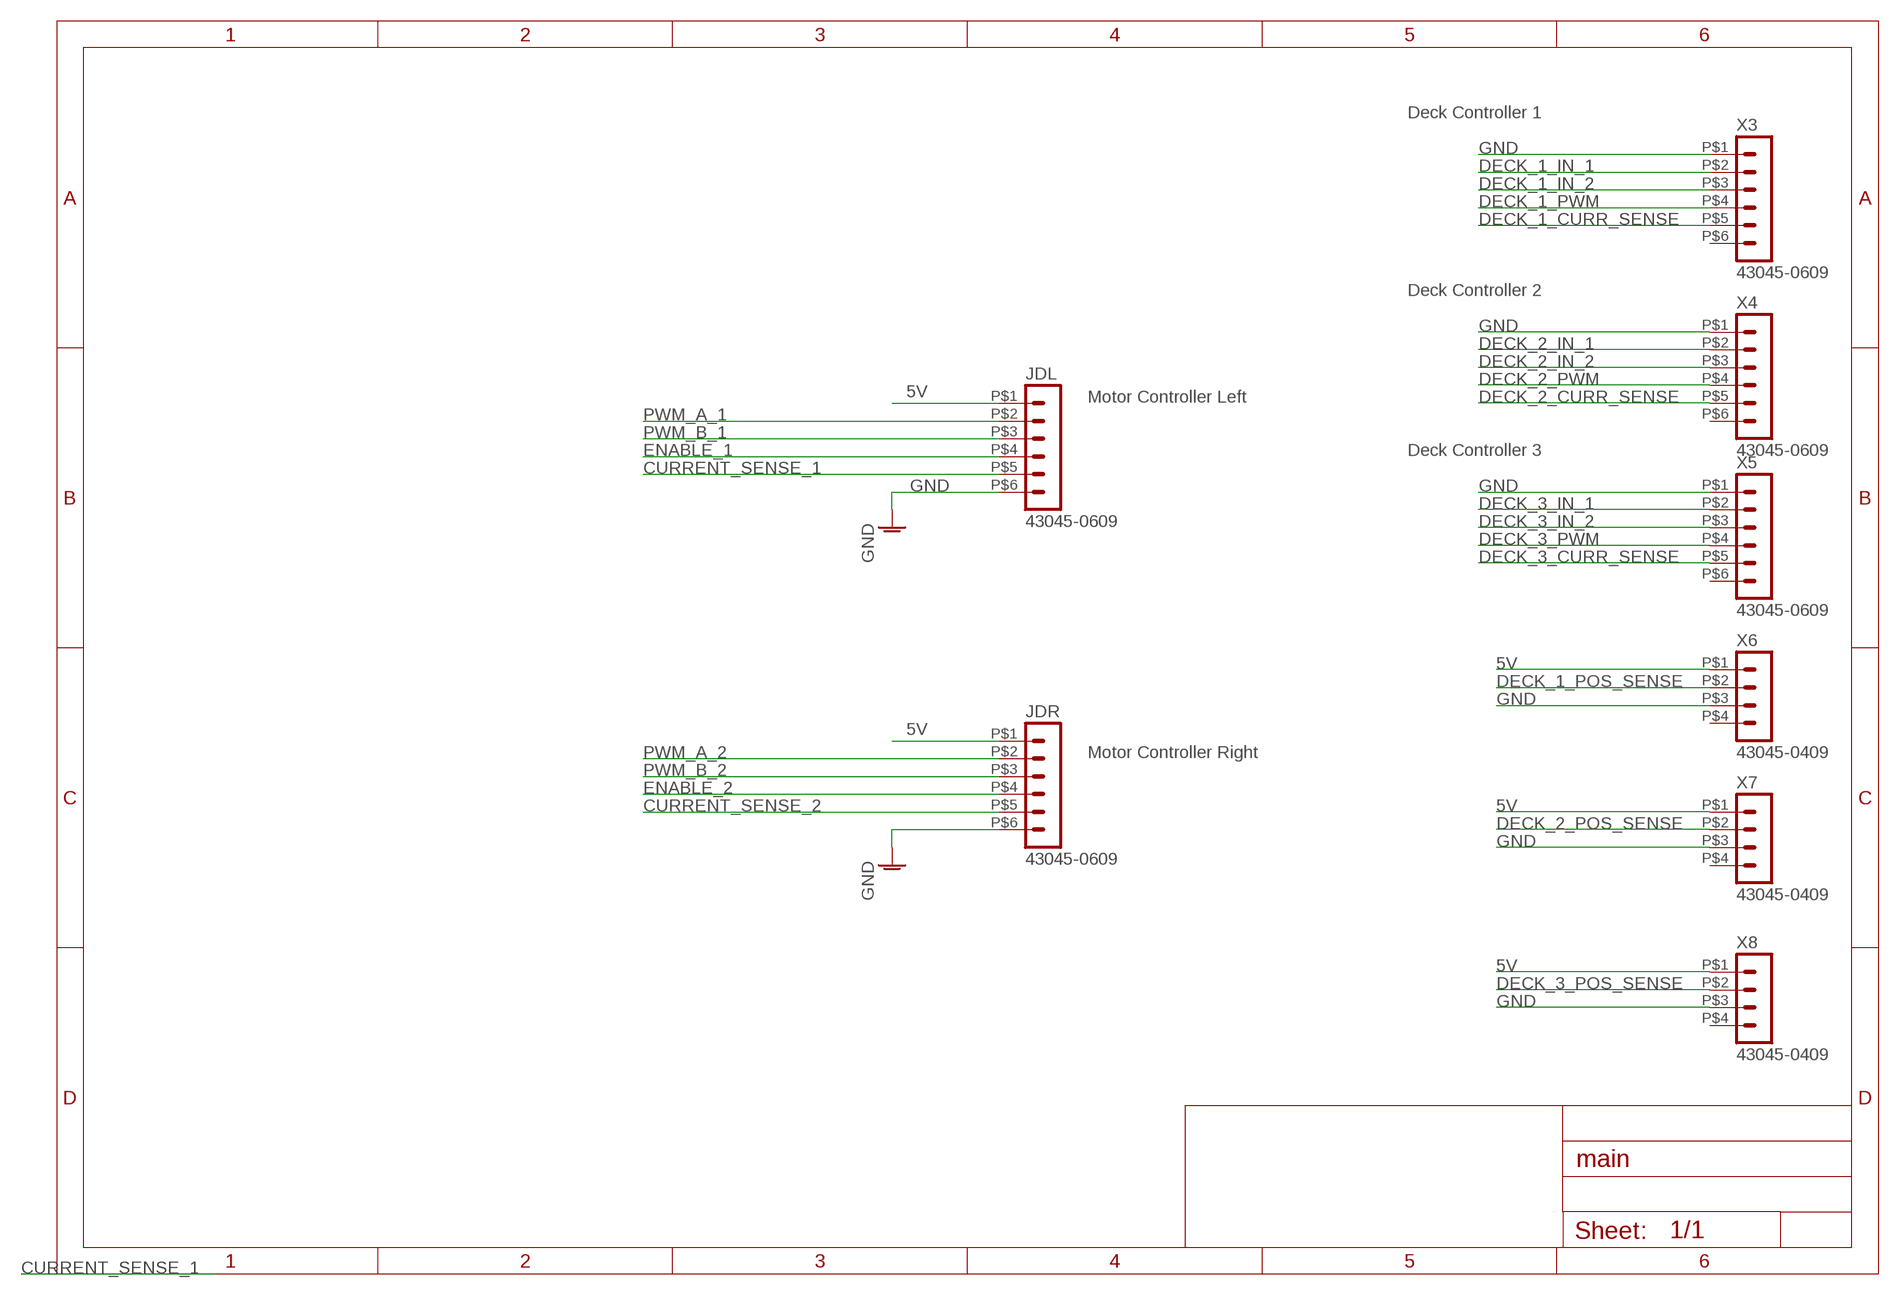
[diagram p16: schematic, module MTR, sheet 1]

### Parts
JDL  43045-0609  HEADER_POS6_43045-0609  [43045-0609]
JDR  43045-0609  HEADER_POS6_43045-0609  [43045-0609]
X3  43045-0609  HEADER_POS6_43045-0609  [43045-0609]
X4  43045-0609  HEADER_POS6_43045-0609  [43045-0609]
X5  43045-0609  HEADER_POS6_43045-0609  [43045-0609]
X6  43045-0409  HEADER_POS4_43045-0409  [43045-0409]
X7  43045-0409  HEADER_POS4_43045-0409  [43045-0409]
X8  43045-0409  HEADER_POS4_43045-0409  [43045-0409]

### Nets
5V: JDL.P$1 JDR.P$1 X6.P$1 X7.P$1 X8.P$1
CURRENT_SENSE_1: JDL.P$5
CURRENT_SENSE_2: JDR.P$5
DECK_1_CURR_SENSE: X3.P$5
DECK_1_IN_1: X3.P$2
DECK_1_IN_2: X3.P$3
DECK_1_POS_SENSE: X6.P$2
DECK_1_PWM: X3.P$4
DECK_2_CURR_SENSE: X4.P$5
DECK_2_IN_1: X4.P$2
DECK_2_IN_2: X4.P$3
DECK_2_POS_SENSE: X7.P$2
DECK_2_PWM: X4.P$4
DECK_3_CURR_SENSE: X5.P$5
DECK_3_IN_1: X5.P$2
DECK_3_IN_2: X5.P$3
DECK_3_POS_SENSE: X8.P$2
DECK_3_PWM: X5.P$4
ENABLE_1: JDL.P$4
ENABLE_2: JDR.P$4
GND: JDL.P$6 JDR.P$6 X3.P$1 X4.P$1 X5.P$1 X6.P$3 X7.P$3 X8.P$3
PWM_A_1: JDL.P$2
PWM_A_2: JDR.P$2
PWM_B_1: JDL.P$3
PWM_B_2: JDR.P$3
Unconnected: X3.P$6 X4.P$6 X5.P$6 X6.P$4 X7.P$4 X8.P$4

### Notes on the sheet
- Deck Controller 1
- Deck Controller 2
- Motor Controller Left
- Deck Controller 3
- Motor Controller Right

### Library data of the parts
JDL = con-molex-micro-fit-3_0:HEADER_POS6_?: Molex - Micro-Fit 3.0 Series connector, 3.00mm (0.118") pitch header, 6 positions.; DESCRIPTION: CONN HEADER 6POS RT ANG SMD TIN; MANUFACTURER: Phoenix Contact; MPN: 43045-0609; SILK: MTRL
JDR = con-molex-micro-fit-3_0:HEADER_POS6_?: Molex - Micro-Fit 3.0 Series connector, 3.00mm (0.118") pitch header, 6 positions.; DESCRIPTION: CONN HEADER 6POS RT ANG SMD TIN; MANUFACTURER: Phoenix Contact; MPN: 43045-0609; SILK: MTRR
X3-X5 = con-molex-micro-fit-3_0:HEADER_POS6_?: Molex - Micro-Fit 3.0 Series connector, 3.00mm (0.118") pitch header, 6 positions.; DESCRIPTION: CONN HEADER 6POS RT ANG SMD TIN; MANUFACTURER: Phoenix Contact; MPN: 43045-0609
X6-X8 = con-molex-micro-fit-3_0:HEADER_POS4_?: Molex - Micro-Fit 3.0 Series connector, 3.00mm (0.118") pitch header, 4 positions.; DESCRIPTION: CONN HEADER 4POS RT ANG SMD TIN; MANUFACTURER: Molex; MPN: 43045-0409